# EAGLE design js220_evk1 (EAGLE 9.6.2)
REVISION: B
Assembly variants: Standard

## Sheet 1 of 2
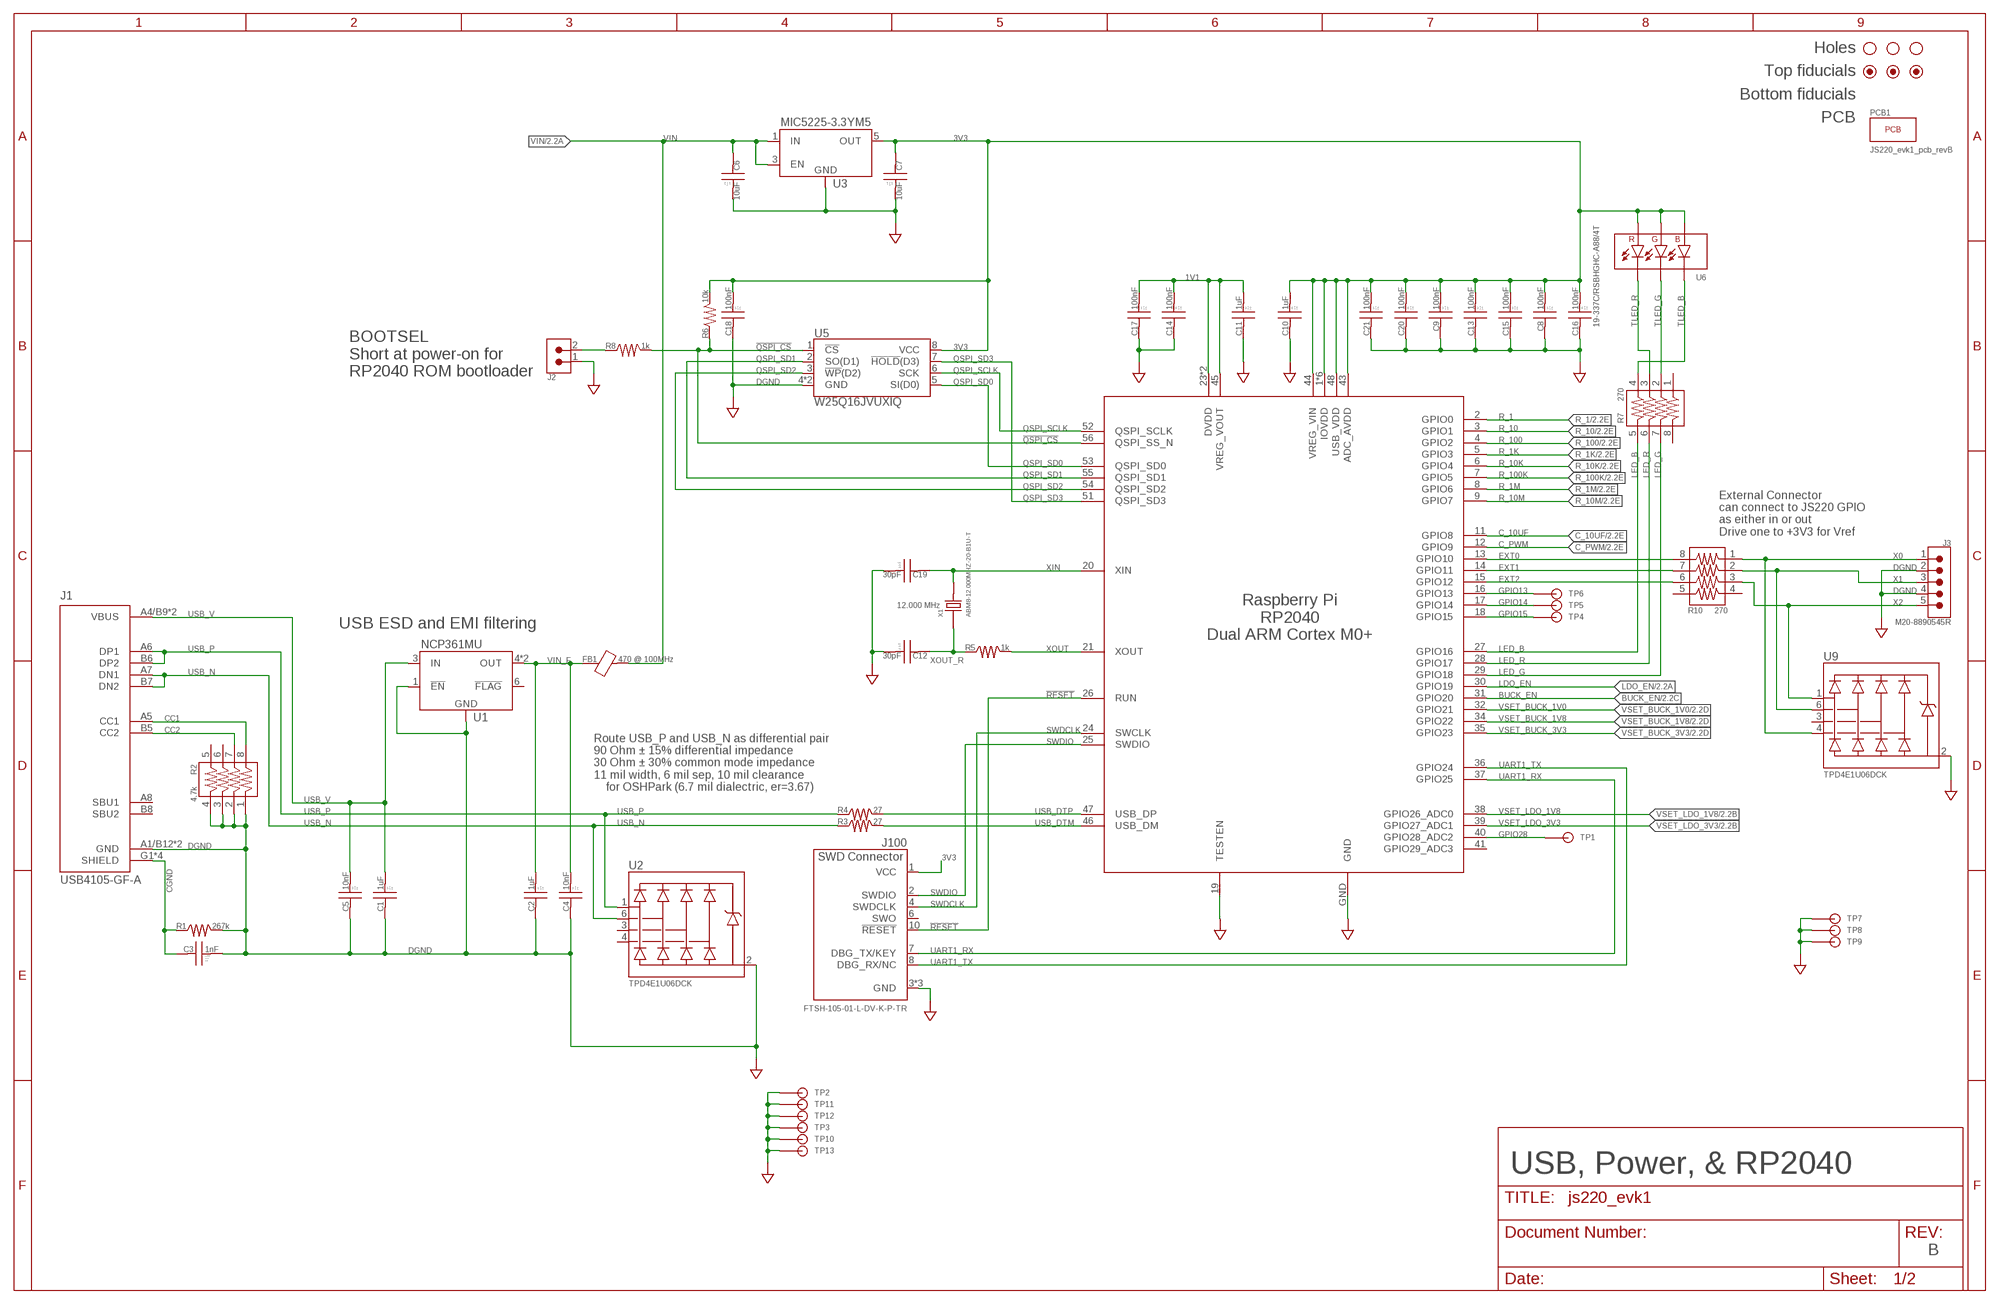
[diagram p0: schematic, sheet 1]
PCB1 (PCB): POPULATE: 1

### Parts
C1  1uF  CAP_0603  [0603]
C2  1uF  CAP_0603  [0603]
C3  1nF  CAP_0805  [0805]
C4  10nF  CAP_0402  [0402]
C5  10nF  CAP_0402  [0402]
C6  10uF  CAP_1206  [1206]
C7  10uF  CAP_0805  [0805]
C8  100nF  CAP_0402  [0402]
C9  100nF  CAP_0402  [0402]
C10  1uF  CAP_0603  [0603]
C11  1uF  CAP_0603  [0603]
C12  30pF  CAP_0402  [0402]
C13  100nF  CAP_0402  [0402]
C14  100nF  CAP_0402  [0402]
C15  100nF  CAP_0402  [0402]
C16  100nF  CAP_0402  [0402]
C17  100nF  CAP_0402  [0402]
C18  100nF  CAP_0402  [0402]
C19  30pF  CAP_0402  [0402]
C20  100nF  CAP_0402  [0402]
C21  100nF  CAP_0402  [0402]
FB1  470 @ 100MHz  FERRITE_BEAD_0603  [0603]
FD1  DNI  FIDUCIAL_1MM  [FIDUCIAL_1MM_2MM]  (not fitted in variant Standard)
FD2  DNI  FIDUCIAL_1MM  [FIDUCIAL_1MM_2MM]  (not fitted in variant Standard)
FD3  DNI  FIDUCIAL_1MM  [FIDUCIAL_1MM_2MM]  (not fitted in variant Standard)
H1  STAND-OFFTIGHT  [STAND-OFF-TIGHT]
H2  STAND-OFFTIGHT  [STAND-OFF-TIGHT]
H3  STAND-OFFTIGHT  [STAND-OFF-TIGHT]
J1  USB4105-GF-A  USB4105_REVA  [GCT_USB4105_REVA]
J2  CONN_0.1_2X1  [CONN_0.1_2X1_M]
J3  M20-8890545R  CONN_0.1_5X1_MSR  [CONN_0.1_5X1_MSR]
J100  FTSH-105-01-L-DV-K-P-TR  ARM_SWD_10_0.05_2X10_S  [CONN_0.050_5X2_M_SM]
R1  267k  RESISTOR_0402  [0402]
R2  4.7k  RESISTOR_4_0804  [0402X4]
R3  27  RESISTOR_0402  [0402]
R4  27  RESISTOR_0402  [0402]
R5  1k  RESISTOR_0402  [0402]
R6  10k  RESISTOR_0402  [0402]
R7  270  RESISTOR_4_0804  [0402X4]
R8  1k  RESISTOR_0402  [0402]
R10  270  RESISTOR_4_0804  [0402X4]
TP1  TPTP-PTH0.02  [TP-PTH0.02]
TP2  TPTP-PTH0.02  [TP-PTH0.02]
TP3  TPTP-PTH0.02  [TP-PTH0.02]
TP4  TPTP-PTH0.02  [TP-PTH0.02]
TP5  TPTP-PTH0.02  [TP-PTH0.02]
TP6  TPTP-PTH0.02  [TP-PTH0.02]
TP7  TPTP-PTH0.02  [TP-PTH0.02]
TP8  TPTP-PTH0.02  [TP-PTH0.02]
TP9  TPTP-PTH0.02  [TP-PTH0.02]
TP10  TPTP-PTH0.02  [TP-PTH0.02]
TP11  TPTP-PTH0.02  [TP-PTH0.02]
TP12  TPTP-PTH0.02  [TP-PTH0.02]
TP13  TPTP-PTH0.02  [TP-PTH0.02]
U1  NCP361MU  [UDFN-6]
U2  TPD4E1U06DCK  TVS_4UNI_DCK  [SC-70-6]
U3  MIC5225-3.3YM5  VREG_FIXED+_ENTPS70960DBV  [SOT23-5]
U4  RP2040  [QFN-56G]
U5  W25Q16JVUXIQ  FLASH_SERIAL8_USON8_2X3  [USON-8_2X3]
U6  19-337C/RSBHGHC-A88/4T  LED_RGB6_1.6X1.6  [LED_RGB6_1.6X1.6]
U9  TPD4E1U06DCK  TVS_4UNI_DCK  [SC-70-6]
X1  ABM8-12.000MHZ-20-B1U-T  XTAL-2_XTAL4_3.2X2.5  [XTAL4_3.2X2.5]

### Nets
1V1: C11.2 C14.2 C17.2 U4.23(DVDD) U4.45(VREG_VOUT) U4.50(DVDD)
3V3: C7.1 C8.2 C9.2 C10.2 C13.2 C15.2 C16.2 C18.2 C20.2 C21.2 J100.1(VCC) R6.2 U3.5(OUT) U4.1(IOVDD) U4.10(IOVDD) U4.22(IOVDD) U4.33(IOVDD) U4.42(IOVDD) U4.43(ADC_AVDD) U4.44(VREG_VIN) U4.48(USB_VDD) U4.49(IOVDD) U5.8(VCC) U6.2(GREEN_ANODE+) U6.4(RED_ANODE+) U6.6(BLUE_ANODE+)
!QSPI_CS: R6.1 R8.2 U4.56(QSPI_SS_N) U5.1(!CS!)
!RESET: J100.10(!RESET) U4.26(RUN)
BUCK_EN: U4.31(GPIO20) ; also sheet 2
C_10UF: U4.11(GPIO8) ; also sheet 2
C_PWM: U4.12(GPIO9) ; also sheet 2
CC1: J1.A5(CC1) R2.8(1B)
CC2: J1.B5(CC2) R2.7(2B)
CGND: C3.1 J1.G1(SHIELD) J1.G2(SHIELD) J1.G3(SHIELD) J1.G4(SHIELD) R1.1
DGND: C1.1 C2.1 C3.2 C4.1 C5.1 C6.2 C7.2 C8.1 C9.1 C10.1 C11.1 C12.2 C13.1 C14.1 C15.1 C16.1 C17.1 C18.1 C19.2 C20.1 C21.1 J1.A1/B12(GND) J1.B1/A12(GND) J2.1 J3.2 J3.4 J100.3(GND) J100.5(GND) J100.9(GND) R1.2 R2.1(1A) R2.2(2A) R2.3(3A) R2.4(4A) TP2.1(TP) TP3.1(TP) TP7.1(TP) TP8.1(TP) TP9.1(TP) TP10.1(TP) TP11.1(TP) TP12.1(TP) TP13.1(TP) U1.1(!EN) U1.2(GND) U1.GND@PAD(GND) U2.2(GND) U3.2(GND) U4.19(TESTEN) U4.GND U5.4(GND) U5.9(GND) U9.2(GND) ; supply symbol labelled GND_SIGNAL ; also sheet 2
EXT0: R10.8(1B) U4.13(GPIO10)
EXT1: R10.7(2B) U4.14(GPIO11)
EXT2: R10.6(3B) U4.15(GPIO12)
GPIO13: TP6.1(TP) U4.16(GPIO13)
GPIO14: TP5.1(TP) U4.17(GPIO14)
GPIO15: TP4.1(TP) U4.18(GPIO15)
GPIO28: TP1.1(TP) U4.40(GPIO28_ADC2)
LDO_EN: U4.30(GPIO19) ; also sheet 2
LED_B: R7.5(4B) U4.27(GPIO16)
LED_G: R7.7(2B) U4.29(GPIO18)
LED_R: R7.6(3B) U4.28(GPIO17)
N$1: J2.2 R8.1
QSPI_SCLK: U4.52(QSPI_SCLK) U5.6(SCK)
QSPI_SD0: U4.53(QSPI_SD0) U5.5(SI(D0))
QSPI_SD1: U4.55(QSPI_SD1) U5.2(SO(D1))
QSPI_SD2: U4.54(QSPI_SD2) U5.3(!WP!(D2))
QSPI_SD3: U4.51(QSPI_SD3) U5.7(!HOLD!(D3))
R_1: U4.2(GPIO0) ; also sheet 2
R_1K: U4.5(GPIO3) ; also sheet 2
R_1M: U4.8(GPIO6) ; also sheet 2
R_10: U4.3(GPIO1) ; also sheet 2
R_10K: U4.6(GPIO4) ; also sheet 2
R_10M: U4.9(GPIO7) ; also sheet 2
R_100: U4.4(GPIO2) ; also sheet 2
R_100K: U4.7(GPIO5) ; also sheet 2
SWDCLK: J100.4(SWDCLK) U4.24(SWCLK)
SWDIO: J100.2(SWDIO) U4.25(SWDIO)
TLED_B: R7.4(4A) U6.5(BLUE_CATHODE-)
TLED_G: R7.2(2A) U6.1(GREEN_CATHODE-)
TLED_R: R7.3(3A) U6.3(RED_CATHODE-)
UART1_RX: J100.7(DBG_TX/KEY) U4.37(GPIO25)
UART1_TX: J100.8(DBG_RX/NC) U4.36(GPIO24)
USB_DTM: R3.2 U4.46(USB_DM)
USB_DTP: R4.2 U4.47(USB_DP)
USB_N [USB]: J1.A7(DN1) J1.B7(DN2) R3.1 U2.6(D1-)
USB_P [USB]: J1.A6(DP1) J1.B6(DP2) R4.1 U2.1(D1+)
USB_V: C1.2 C5.2 J1.A4/B9(VBUS) J1.B4/A9(VBUS) U1.3(IN)
VIN: C6.1 FB1.2 U3.1(IN) U3.3(EN) ; also sheet 2
VIN_F: C2.2 C4.2 FB1.1 U1.4(OUT) U1.5(OUT)
VSET_BUCK_1V0: U4.32(GPIO21) ; also sheet 2
VSET_BUCK_1V8: U4.34(GPIO22) ; also sheet 2
VSET_BUCK_3V3: U4.35(GPIO23) ; also sheet 2
VSET_LDO_1V8: U4.38(GPIO26_ADC0) ; also sheet 2
VSET_LDO_3V3: U4.39(GPIO27_ADC1) ; also sheet 2
X0: J3.1 R10.1(1A) U9.4(D2-)
X1: J3.3 R10.2(2A) U9.6(D1-)
X2: J3.5 R10.3(3A) U9.1(D1+)
XIN: C19.1 U4.20(XIN) X1.3
XOUT: R5.2 U4.21(XOUT)
XOUT_R: C12.1 R5.1 X1.1
Unconnected: J1.A8(SBU1) J1.B8(SBU2) J100.6(SWO) R2.5(4B) R2.6(3B) R7.1(1A) R7.8(1B) R10.4(4A) R10.5(4B) U1.6(!FLAG) U2.3(D2+) U2.4(D2-) U4.41(GPIO29_ADC3) U9.3(D2+)

### Notes on the sheet
- Holes
  Top fiducials
  Bottom fiducials
  PCB
- BOOTSEL
  Short at power-on for
  RP2040 ROM bootloader
- External Connector
  can connect to JS220 GPIO
  as either in or out
  Drive one to +3V3 for Vref
- 12.000 MHz
- USB ESD and EMI filtering
- Route USB_P and USB_N as differential pair
  90 Ohm ± 15% differential impedance
  30 Ohm ± 30% common mode impedance
  11 mil width, 6 mil sep, 10 mil clearance
      for OSHPark (6.7 mil dialectric, er=3.67)
- USB, Power, & RP2040

## Sheet 2 of 2
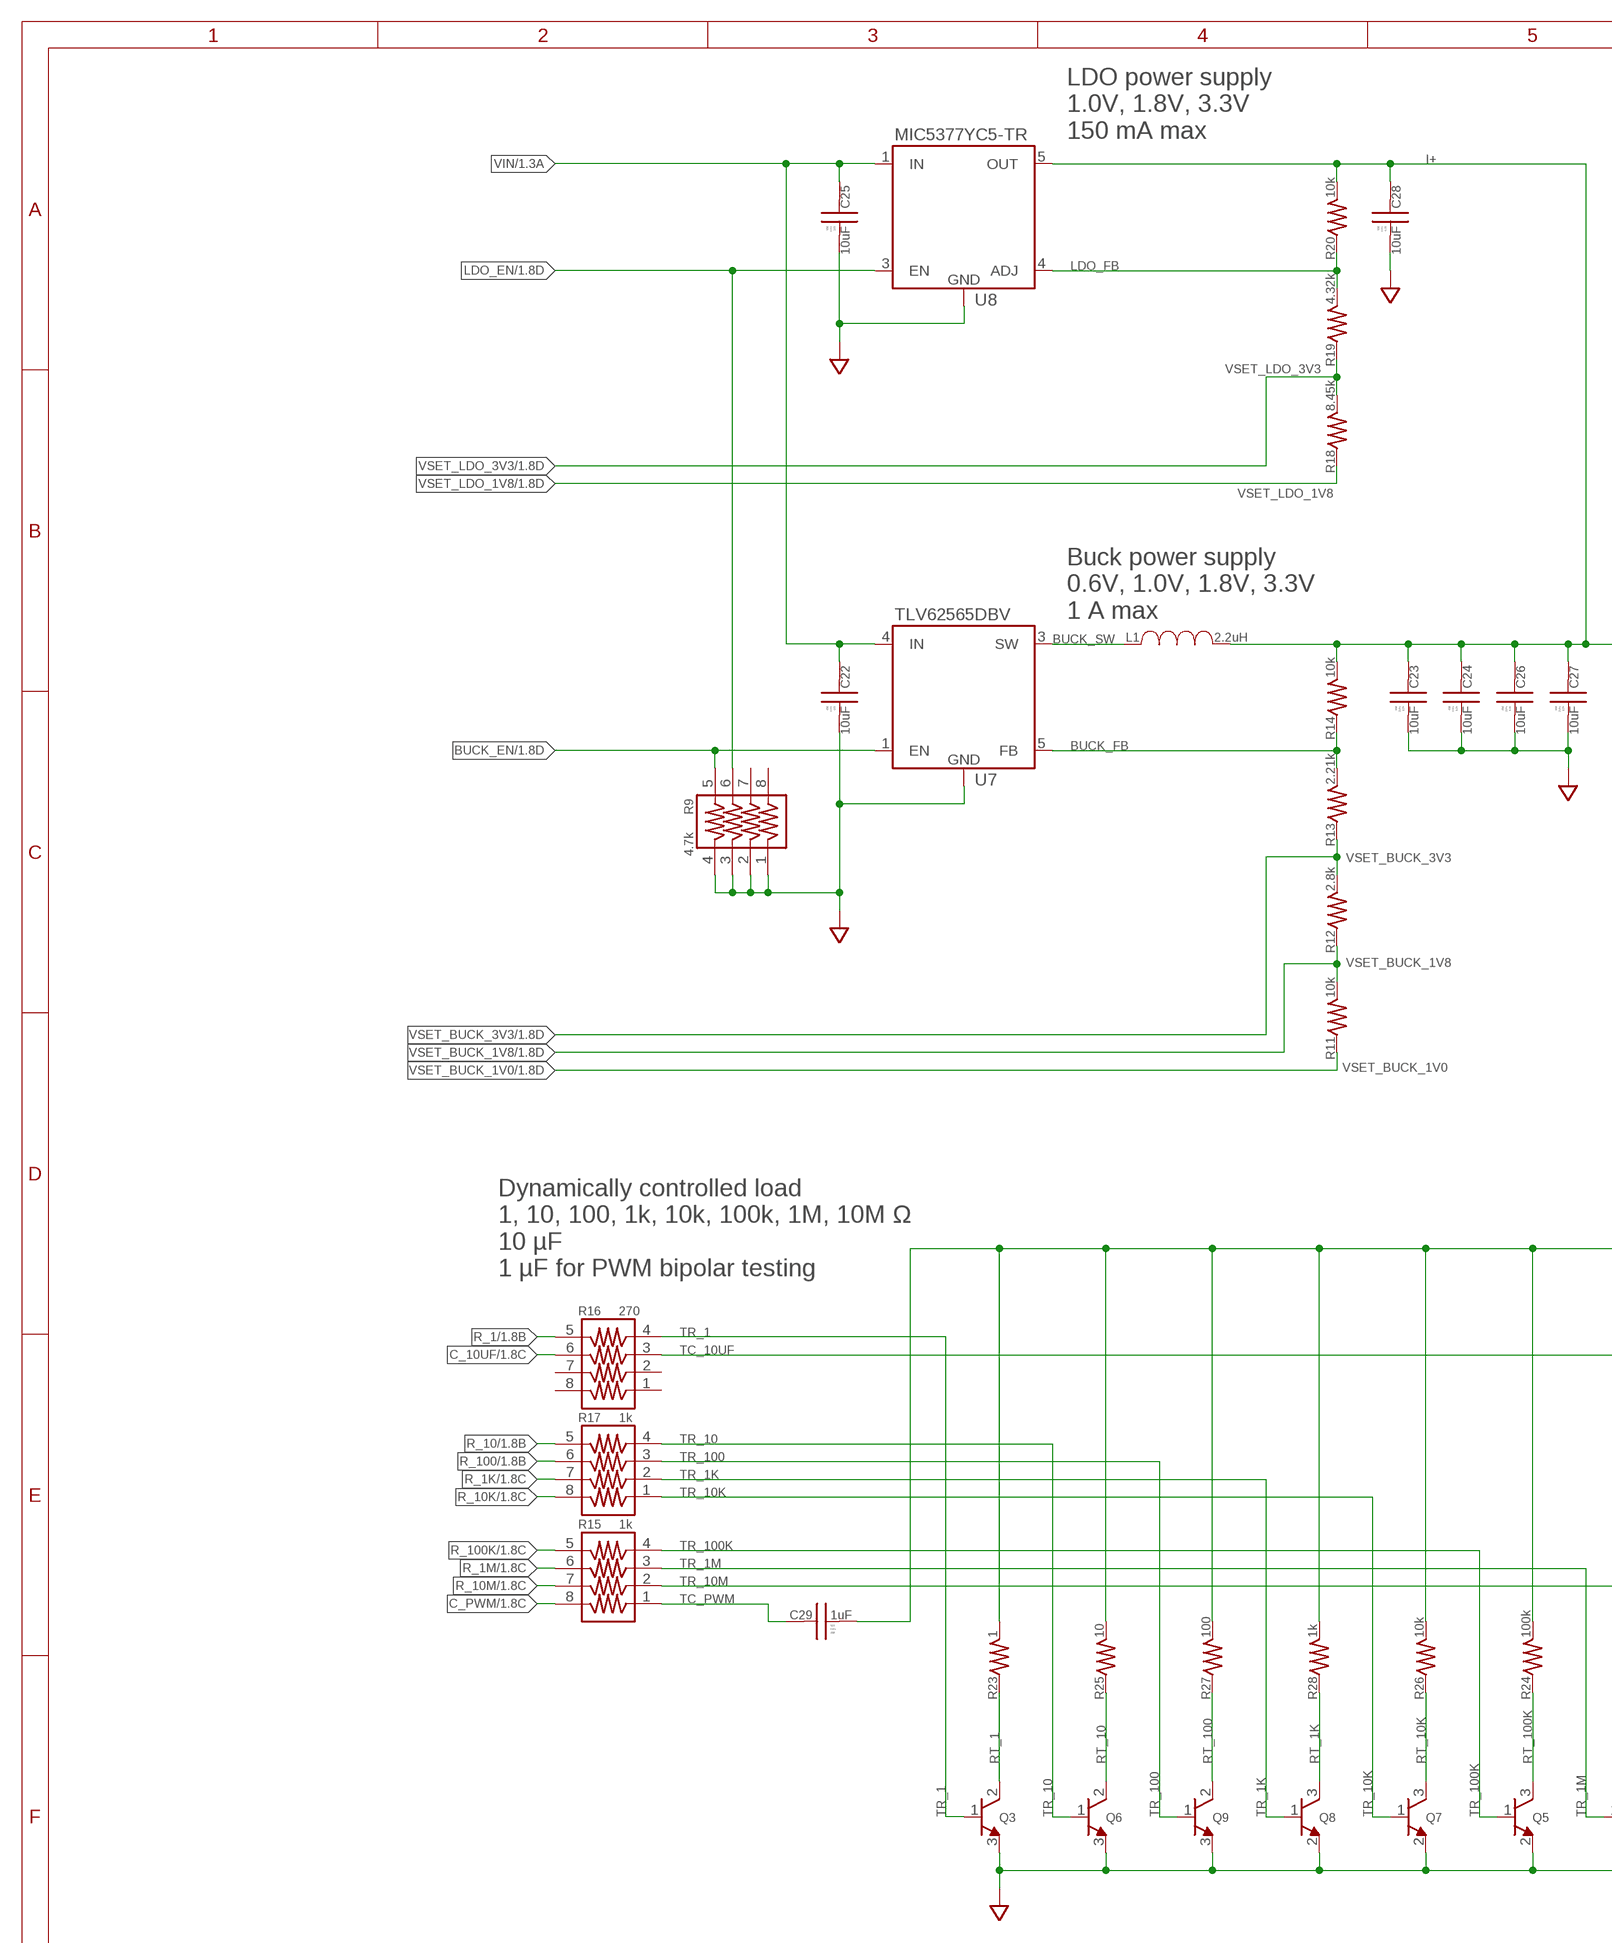
[diagram p1: schematic, sheet 2, part 1 of 2]
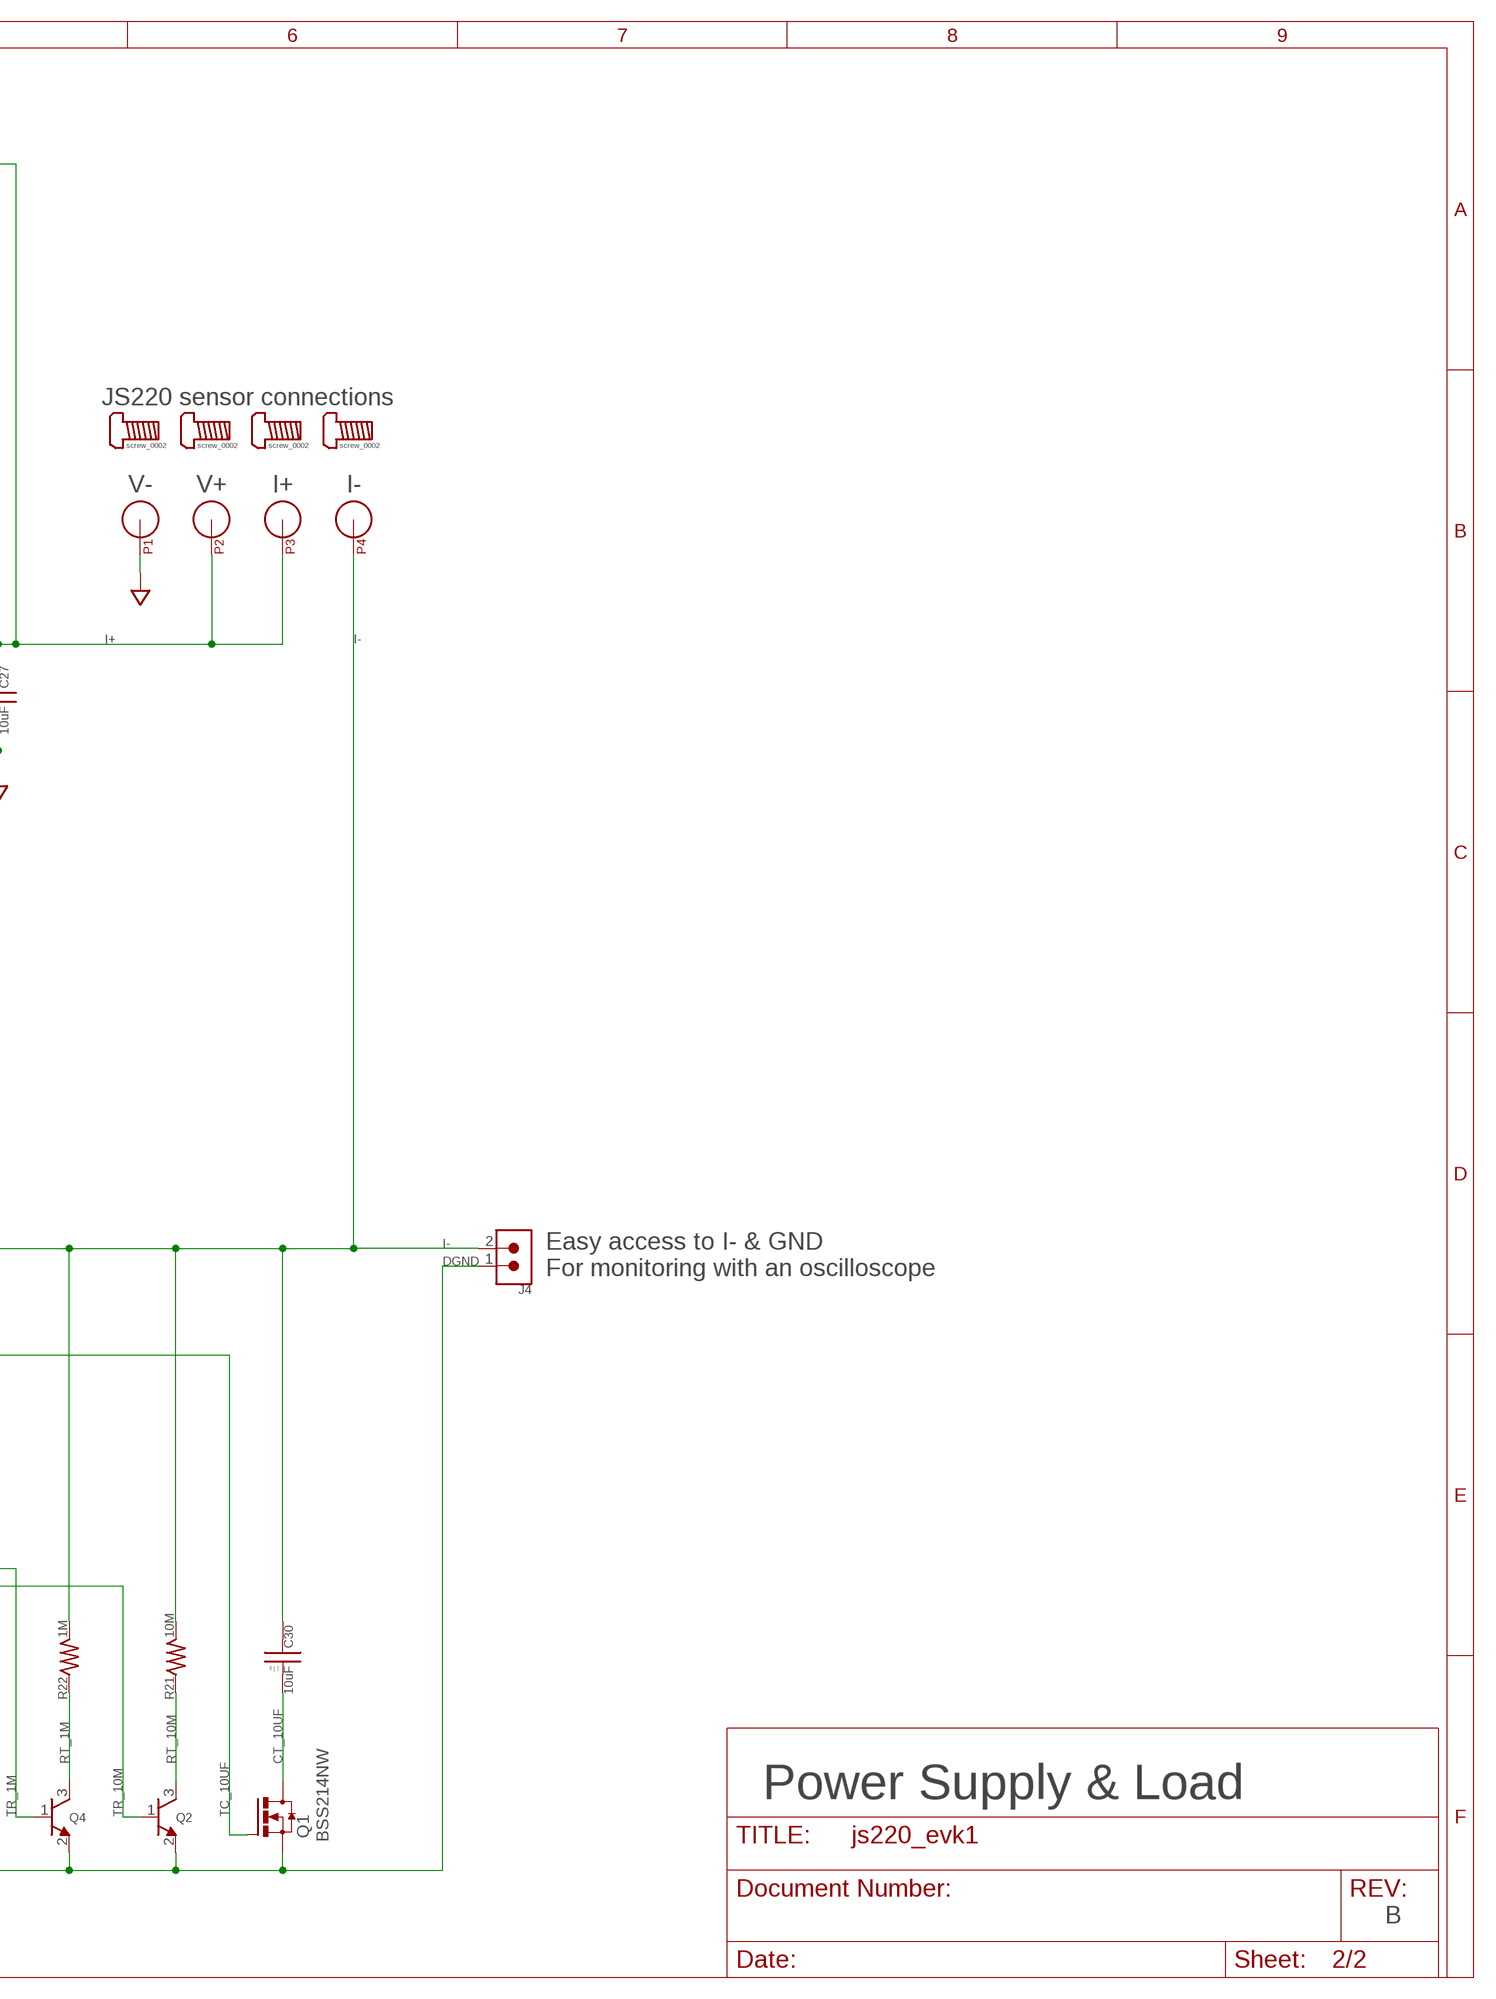
[diagram p2: schematic, sheet 2, part 2 of 2]
U$1 (SCREW): POPULATE: 1
U$2 (SCREW): POPULATE: 1
U$3 (SCREW): POPULATE: 1
U$4 (SCREW): POPULATE: 1

### Parts
C22  10uF  CAP_1206  [1206]
C23  10uF  CAP_0805  [0805]
C24  10uF  CAP_0805  [0805]
C25  10uF  CAP_1206  [1206]
C26  10uF  CAP_0805  [0805]
C27  10uF  CAP_0805  [0805]
C28  10uF  CAP_0805  [0805]
C29  1uF  CAP_0603  [0603]
C30  10uF  CAP_0805  [0805]
J4  CONN_0.1_2X1  [CONN_0.1_2X1_M]
L1  2.2uH  INDUCTOR_LPS4018  [LPS4018]
P1  P55-271F40N  BANANA-PLUG72918  [72918]
P2  P55-271F40N  BANANA-PLUG72918  [72918]
P3  P55-271F40N  BANANA-PLUG72918  [72918]
P4  P55-271F40N  BANANA-PLUG72918  [72918]
Q1  BSS214NW  MOSFET_N_SOT323_GSD  [SOT323-3]
Q2  BC848W  BJT_NPN_SOT323  [SOT323-3]
Q3  PBSS4240X  BJT_NPN_SOT89  [SOT-89]
Q4  BC848W  BJT_NPN_SOT323  [SOT323-3]
Q5  BC848W  BJT_NPN_SOT323  [SOT323-3]
Q6  PBSS4240X  BJT_NPN_SOT89  [SOT-89]
Q7  BC848W  BJT_NPN_SOT323  [SOT323-3]
Q8  BC848W  BJT_NPN_SOT323  [SOT323-3]
Q9  PBSS4240X  BJT_NPN_SOT89  [SOT-89]
R9  4.7k  RESISTOR_4_0804  [0402X4]
R11  10k  RESISTOR_0402  [0402]
R12  2.8k  RESISTOR_0402  [0402]
R13  2.21k  RESISTOR_0402  [0402]
R14  10k  RESISTOR_0402  [0402]
R15  1k  RESISTOR_4_0804  [0402X4]
R16  270  RESISTOR_4_0804  [0402X4]
R17  1k  RESISTOR_4_0804  [0402X4]
R18  8.45k  RESISTOR_0402  [0402]
R19  4.32k  RESISTOR_0402  [0402]
R20  10k  RESISTOR_0402  [0402]
R21  10M  RESISTOR_0402  [0402]
R22  1M  RESISTOR_0402  [0402]
R23  1  RESISTOR_2512  [2512]
R24  100k  RESISTOR_0402  [0402]
R25  10  RESISTOR_2512  [2512]
R26  10k  RESISTOR_0402  [0402]
R27  100  RESISTOR_1206  [1206]
R28  1k  RESISTOR_0402  [0402]
U7  TLV62565DBV  [SOT23-5]
U8  MIC5377YC5-TR  VREG+_FB_EN_MIC5376-YC5  [SC-70-5]

### Nets
BUCK_EN: R9.5(4B) U7.1(EN) ; also sheet 1
BUCK_FB: R13.2 R14.1 U7.5(FB)
BUCK_SW: L1.1 U7.3(SW)
C_10UF: R16.6(3B) ; also sheet 1
C_PWM: R15.8(1B) ; also sheet 1
CT_10UF: C30.2 Q1.3(D)
DGND: C22.2 C23.2 C24.2 C25.2 C26.2 C27.2 C28.2 J4.1 P1.1 Q1.2(S) Q2.2(EMITTER) Q3.3(EMITTER) Q4.2(EMITTER) Q5.2(EMITTER) Q6.3(EMITTER) Q7.2(EMITTER) Q8.2(EMITTER) Q9.3(EMITTER) R9.1(1A) R9.2(2A) R9.3(3A) R9.4(4A) U7.2(GND) U8.2(GND) ; supply symbol labelled GND_SIGNAL ; also sheet 1
I+: C23.1 C24.1 C26.1 C27.1 C28.1 L1.2 P2.1 P3.1 R14.2 R20.2 U8.5(OUT)
I-: C29.2 C30.1 J4.2 P4.1 R21.2 R22.2 R23.2 R24.2 R25.2 R26.2 R27.2 R28.2
LDO_EN: R9.6(3B) U8.3(EN) ; also sheet 1
LDO_FB: R19.2 R20.1 U8.4(ADJ)
R_1: R16.5(4B) ; also sheet 1
R_1K: R17.7(2B) ; also sheet 1
R_1M: R15.6(3B) ; also sheet 1
R_10: R17.5(4B) ; also sheet 1
R_10K: R17.8(1B) ; also sheet 1
R_10M: R15.7(2B) ; also sheet 1
R_100: R17.6(3B) ; also sheet 1
R_100K: R15.5(4B) ; also sheet 1
RT_1: Q3.2(COLLECTOR) R23.1
RT_1K: Q8.3(COLLECTOR) R28.1
RT_1M: Q4.3(COLLECTOR) R22.1
RT_10: Q6.2(COLLECTOR) R25.1
RT_10K: Q7.3(COLLECTOR) R26.1
RT_10M: Q2.3(COLLECTOR) R21.1
RT_100: Q9.2(COLLECTOR) R27.1
RT_100K: Q5.3(COLLECTOR) R24.1
TC_10UF: Q1.1(G) R16.3(3A)
TC_PWM: C29.1 R15.1(1A)
TR_1: Q3.1(BASE) R16.4(4A)
TR_1K: Q8.1(BASE) R17.2(2A)
TR_1M: Q4.1(BASE) R15.3(3A)
TR_10: Q6.1(BASE) R17.4(4A)
TR_10K: Q7.1(BASE) R17.1(1A)
TR_10M: Q2.1(BASE) R15.2(2A)
TR_100: Q9.1(BASE) R17.3(3A)
TR_100K: Q5.1(BASE) R15.4(4A)
VIN: C22.1 C25.1 U7.4(IN) U8.1(IN) ; also sheet 1
VSET_BUCK_1V0: R11.1 ; also sheet 1
VSET_BUCK_1V8: R11.2 R12.1 ; also sheet 1
VSET_BUCK_3V3: R12.2 R13.1 ; also sheet 1
VSET_LDO_1V8: R18.1 ; also sheet 1
VSET_LDO_3V3: R18.2 R19.1 ; also sheet 1
Unconnected: R9.7(2B) R9.8(1B) R16.1(1A) R16.2(2A) R16.7(2B) R16.8(1B)

### Notes on the sheet
- LDO power supply
  1.0V, 1.8V, 3.3V
  150 mA max
- JS220 sensor connections
- V- | V+ | I+ | I-
- Buck power supply
  0.6V, 1.0V, 1.8V, 3.3V
  1 A max
- Dynamically controlled load
  1, 10, 100, 1k, 10k, 100k, 1M, 10M Ω
  10 µF
  1 µF for PWM bipolar testing
- Easy access to I- & GND
  For monitoring with an oscilloscope
- Power Supply & Load

## Library data of the parts
C1 C2 C10 C11 C29 = jetperch:CAP; DIELECTRIC: X5R; POPULATE: 1; TOLERANCE: 20%; VOLTAGE: 50V
C3 = jetperch:CAP; DIELECTRIC: X5R; POPULATE: 1; TOLERANCE: 20%; VOLTAGE: 1000V
C4 C5 C8 C9 C13-C18 C20 C21 = jetperch:CAP; DIELECTRIC: X7R; POPULATE: 1; TOLERANCE: 10%; VOLTAGE: 50V
C6 C22 C25 = jetperch:CAP; DIELECTRIC: X5R; POPULATE: 1; TOLERANCE: 20%; VOLTAGE: 10V
C7 C23 C24 C26-C28 C30 = jetperch:CAP; DIELECTRIC: X5R; POPULATE: 1; TOLERANCE: 20%; VOLTAGE: 6.3V
C12 C19 = jetperch:CAP; DIELECTRIC: C0G; POPULATE: 1; TOLERANCE: 5%; VOLTAGE: 50V
FB1 = jetperch:FERRITE_BEAD; PN: FB0603_470; POPULATE: 1
FD1-FD3 = jetperch:FIDUCIAL; POPULATE: 0
H1-H3 = jetperch:STAND-OFF: #4 Stand Off This is the mechanical footprint for a #4 phillips button head screw. Use the keepout ring to avoid running the screw head into surrounding components. SKU : PRT-00447; POPULATE: 0
J1 = jetperch:USB4105_REVA: USB Type C Receptacle for USB 2.0 SMT Type, PCB Top Mount USB4105-GF-A; DESCRIPTION: USB-C (USB TYPE-C) USB 2.0 Receptacle Connector 24 (16+8 Dummy) Position Surface Mount, Right Angle; Through Hole; DIGI-KEY_PART_NUMBER: 2073-USB4105-GF-ACT-ND; MF: Global Connector Technology; MP: USB4105; MPN: USB4105-GF-A; PACKAGE: Package; POPULATE: 1
J2 J4 = jetperch:CONN_0.1_2X1: 2x1 0.1" header; POPULATE: 0
J3 = jetperch:CONN_0.1_5X1; MPN: M20-8890545R; POPULATE: 1
J100 = jetperch:ARM_SWD_10; MPN: FTSH-105-01-L-DV-K-P-TR; POPULATE: 0
L1 = jetperch:INDUCTOR; MPN: NRS4018T2R2MDGJ; POPULATE: 1
P1-P4 = jetperch:BANANA-PLUG; POPULATE: 1
Q1 = jetperch:MOSFET_N; MPN: BSS214NWH6327XTSA1; POPULATE: 1
Q2 Q4 Q5 Q7 Q8 = jetperch:BJT_NPN; POPULATE: 1
Q3 Q6 Q9 = jetperch:BJT_NPN; MPN: PBSS4240X; POPULATE: 1
R1 R3 R4 R21 R22 = jetperch:RESISTOR; POPULATE: 1; TEMP_CO: 100 ppm/°C; TOLERANCE: 1%; WATTAGE: 0.062W
R2 R7 R9 R10 R15-R17 = jetperch:RESISTOR_4: Matching footprints: 1206x4 For panasonic EXB-V8V series resistors 0402x4 for panasonc ECB28V series resistors; POPULATE: 1; TEMP_CO: 200 ppm/°C; TOLERANCE: 5%; WATTAGE: 0.062W
R5 R8 R11-R14 R20 R24 R26 R28 = jetperch:RESISTOR; POPULATE: 1; TEMP_CO: 25 ppm/°C; TOLERANCE: 0.1%; WATTAGE: 0.062W
R6 = jetperch:RESISTOR; POPULATE: 0; TEMP_CO: 25 ppm/°C; TOLERANCE: 0.1%; WATTAGE: 0.062W
R18 R19 = jetperch:RESISTOR; POPULATE: 1; TEMP_CO: 25 ppm/°C; TOLERANCE: 1%; WATTAGE: 0.062W
R23 R25 = jetperch:RESISTOR; POPULATE: 1; TEMP_CO: 100 ppm/°C; TOLERANCE: 1%; WATTAGE: 2W
R27 = jetperch:RESISTOR; POPULATE: 1; TEMP_CO: 100 ppm/°C; TOLERANCE: 1%; WATTAGE: 0.5W
TP1-TP13 = jetperch:TP: https://www.smithsinterconnect.com/ for S-075, S-100, S4; POPULATE: 0
U1 = jetperch:NCP361; MPN: NCP361MUTBG; POPULATE: 1
U2 U9 = jetperch:TVS_4UNI: For TI TPD4E1U06; PN: TPD4E1U06DCK; POPULATE: 1
U3 = jetperch:VREG_FIXED+_EN: Positive fixed voltage regulators with enable.; MPN: MIC5225-3.3YM5-TR; POPULATE: 1
U4 = jetperch:RP2040; MPN: RP2040; POPULATE: 1
U5 = jetperch:FLASH_SERIAL8: Winbond W25Q32FV 32Mbit (4MB) Flash The W25Q32FV support the standard Serial Peripheral Interface (SPI), Dual/Quad I/O SPI as well as 2-clocks instruction cycle Quad Peripheral Interface (QPI). Datasheet <http://www.winbond.com/resource-files/w25q32fv%20revh%20091613.pdf>; MPN: W25Q16JVUXIQ TR; POPULATE: 1
U6 = jetperch:LED_RGB6: Options include: 6PLCC compatible with Lite-On LTST-G683GEBW 1.6x1.6 compatible with Everlight 19-337C/RSBHGHC-A88/4T; MPN: 19-337C/RSBHGHC-A88/4T; POPULATE: 1
U7 = jetperch:TLV62565: TI TLV62565 in SOT23-5; MPN: TLV62565DBV; POPULATE: 1
U8 = jetperch:VREG+_FB_EN; MPN: MIC5377YC5-TR; POPULATE: 1
X1 = jetperch:XTAL-2; MPN: ABM8-12.000MHZ-20-B1U-T; POPULATE: 1

## Net classes
0 default: width 0.127 mm, drill 0.254 mm, clearance 0.127 mm
1 USB: clearance 0.508 mm to class 0, clearance 0.254 mm
2 EXT_NEG: drill 0.254 mm, clearance 0.635 mm to class 0, clearance 0.635 mm to class 1, clearance 0.152 mm
3 CGND: clearance 0.254 mm to class 0, clearance 1.016 mm to class 1, clearance 1.016 mm to class 2, clearance 0.254 mm

## Board
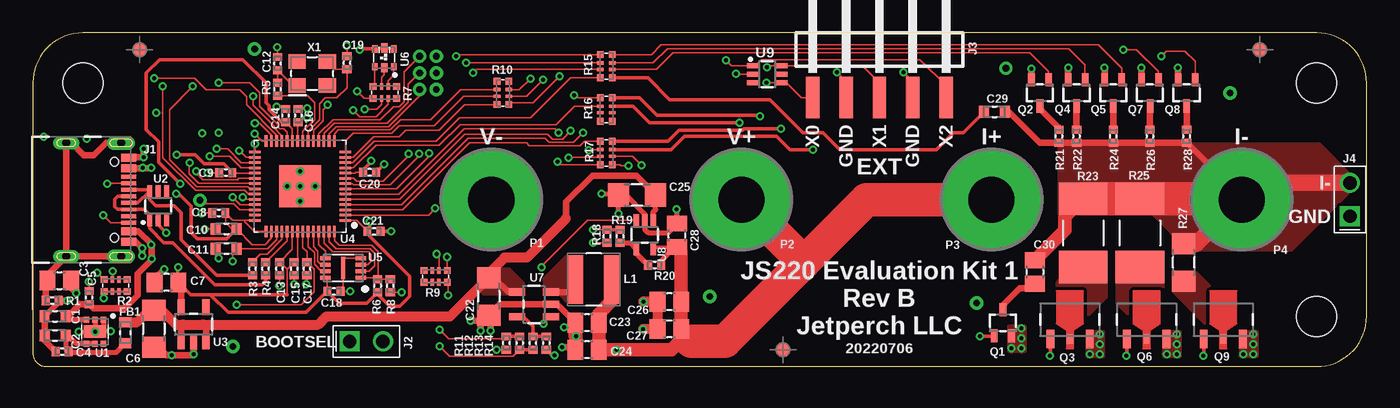
[diagram p3: board, top side]
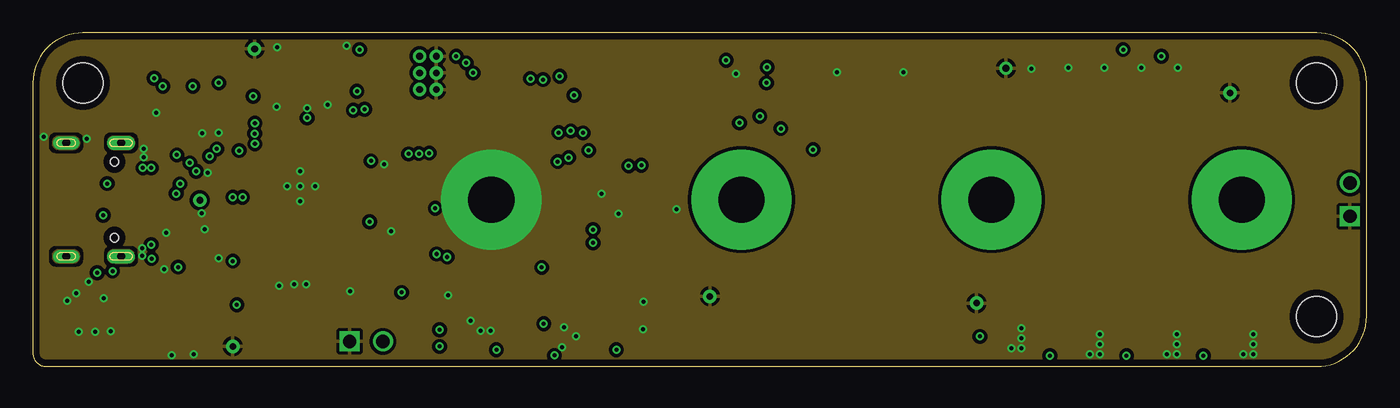
[diagram p4: board, inner layer Route2]
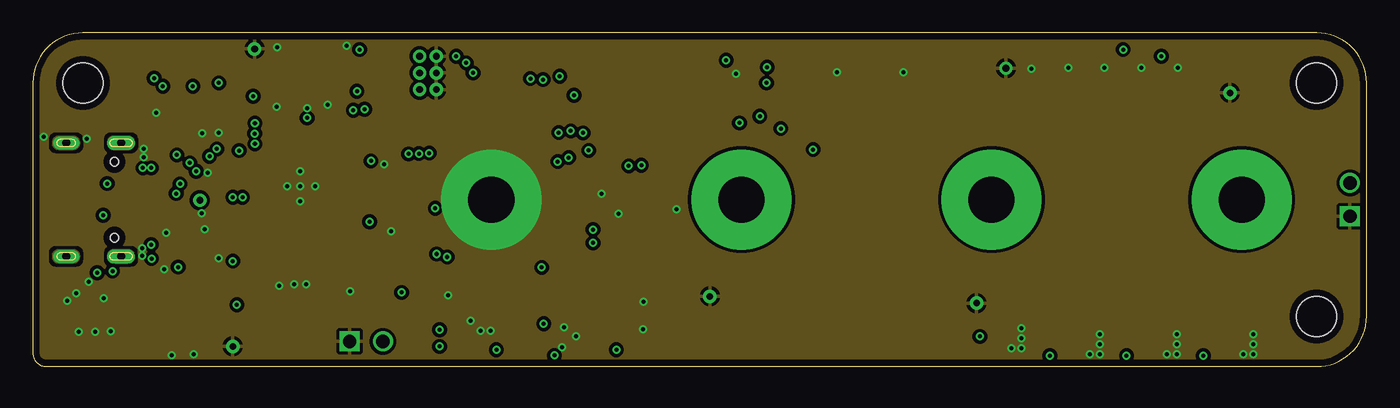
[diagram p5: board, inner layer Route15]
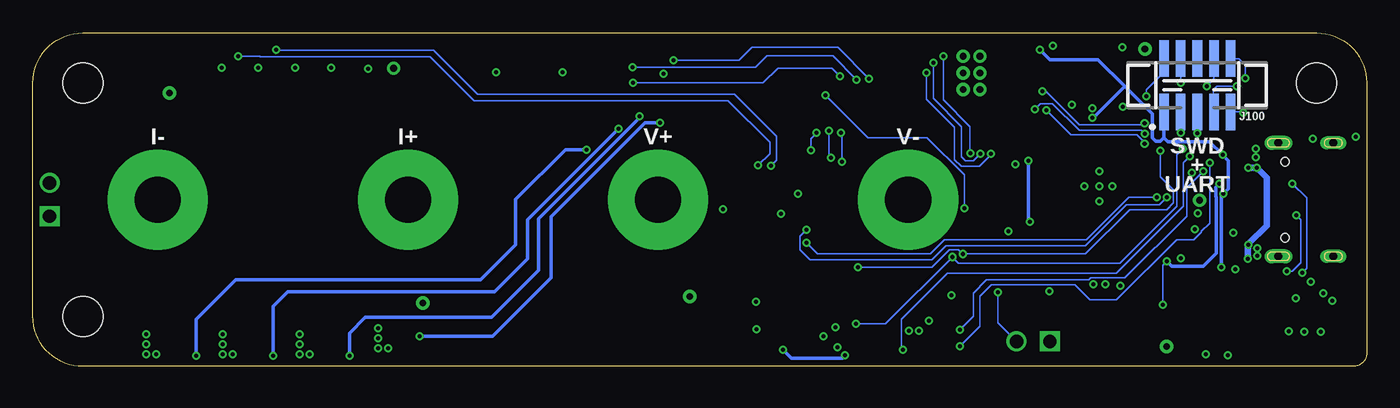
[diagram p6: board, bottom side, seen from below]

Size 101.6 x 25.4 mm. Coordinates in mm from the lower left corner, seen from the top.
Outline: 101.6,3.81 101.6,21.59 arc90 97.79,25.4 3.81,25.4 arc90 0,21.59 0,1.02 arc90 1.02,0 97.79,0 arc90 101.6,3.81
Copper layers (1+2*15+16): Top 0.035559375mm / dielectric 0.17018125mm / Route2 0.01778125mm / dielectric 47mil / Route15 0.01778125mm / dielectric 0.17018125mm / Bottom 0.035559375mm
Design rules "jetperch_4layer_5mil *": minimum track width 5mil, minimum drill 12mil, track to track 5mil, track to pad 5mil, pad to pad 5mil, via to via 5mil, smd to smd 0mil, copper to edge 20mil, drill to drill 8mil, minimum pad ring 6mil, minimum via ring 6mil, stop-mask expansion 0mil, vias tented up to drill 14mil, thermal gap 10mil

### Footprints (pad centres in the part's own frame; a part is rotated, then mirrored left to right if it is on the bottom)
0603 = smd 0.75 x 0.9: 1 -0.8,0; 2 0.8,0
0805 = smd 1.198 x 1.5: 1 -0.899,0; 2 0.899,0
0402 = smd 0.6 x 0.7: 1 -0.5,0; 2 0.5,0
1206 = smd 1.6 x 1.803: 1 -1.422,0; 2 1.422,0
FIDUCIAL_1MM_2MM = smd 1.016 x 1.016: P1 0,0
STAND-OFF-TIGHT = hole 3.048: 0,0
GCT_USB4105_REVA = smd 0.6 x 1.15: A1/B12 -3.2,4.755; A4/B9 -2.4,4.755; B1/A12 3.2,4.755; B4/A9 2.4,4.755 | smd 0.3 x 1.15: A5 -1.25,4.755; A6 -0.25,4.755; A7 0.25,4.755; A8 1.25,4.755; B5 1.75,4.755; B6 0.75,4.755; B7 -0.75,4.755; B8 -1.75,4.755 | drill 0.6 pad 1 long: G1 -4.32,0; G2 4.32,0 | drill 0.6 pad 1.05 long: G3 -4.32,4.18; G4 4.32,4.18 | hole 0.65: 2.89,3.68; -2.89,3.68
CONN_0.1_2X1_M = drill 1.016 square: 1 -1.27,0 | drill 1.016: 2 1.27,0
CONN_0.1_5X1_MSR = smd 1.02 x 3.17: 1 -5.08,-3.665; 2 -2.54,-3.665; 3 0,-3.665; 4 2.54,-3.665; 5 5.08,-3.665
CONN_0.050_5X2_M_SM = smd 0.737 x 2.794: 1 -2.54,-2.032; 2 -2.54,2.032; 3 -1.27,-2.032; 4 -1.27,2.032; 5 0,-2.032; 6 0,2.032; 7 1.27,-2.032; 8 1.27,2.032; 9 2.54,-2.032; 10 2.54,2.032
LPS4018 = smd 1.2 x 3.7: 1 -1.4,0; 2 1.4,0
72918 = drill 3.505 pad 7.62: 1 0,0
SOT323-3 = smd 0.5 x 1: 1 -0.65,-1; 2 0.65,-1; 3 0,1
SOT-89 = smd 0.6 x 1.4: 1 -1.5,-1.475; 3 1.5,-1.475 | smd 0.45 x 0.7: 2 0,-1.475
0402X4 = smd 0.525 x 0.5: 1 -0.887,-0.45; 4 0.887,-0.45; 5 0.887,0.45; 8 -0.887,0.45 | smd 0.25 x 0.5: 2 -0.25,-0.45; 3 0.25,-0.45; 6 0.25,0.45; 7 -0.25,0.45
2512 = smd 2.438 x 3.708: 1 -2.591,0; 2 2.591,0
TP-PTH0.02 = drill 0.508 pad 1.016: 1 0,0
UDFN-6 = smd 0.4 x 0.47: 1 -0.65,-0.915; 2 0,-0.915; 3 0.65,-0.915; 4 0.65,0.915; 5 0,0.915; 6 -0.65,0.915 | smd 1.7 x 0.95: GND@PAD 0,0
SC-70-6 = smd 0.4 x 0.9: 1 -0.65,-1.1; 2 0,-1.1; 3 0.65,-1.1; 4 0.65,1.1; 5 0,1.1; 6 -0.65,1.1
SOT23-5 = smd 0.55 x 1.2: 1 -0.95,-1.3; 2 0,-1.3; 3 0.95,-1.3; 4 0.95,1.3; 5 -0.95,1.3
QFN-56G = smd 0.875 x 0.2: 1 -3.438,2.6; 2 -3.438,2.2; 3 -3.438,1.8; 4 -3.438,1.4; 5 -3.438,1; 6 -3.438,0.6; 7 -3.438,0.2; 8 -3.438,-0.2; 9 -3.438,-0.6; 10 -3.438,-1; 11 -3.438,-1.4; 12 -3.438,-1.8; 13 -3.438,-2.2; 14 -3.438,-2.6; 29 3.438,-2.6; 30 3.438,-2.2; 31 3.438,-1.8; 32 3.438,-1.4; 33 3.438,-1; 34 3.438,-0.6; 35 3.438,-0.2; 36 3.438,0.2; 37 3.438,0.6; 38 3.438,1; 39 3.438,1.4; 40 3.438,1.8; 41 3.438,2.2; 42 3.438,2.6 | smd 0.2 x 0.875: 15 -2.6,-3.438; 16 -2.2,-3.438; 17 -1.8,-3.438; 18 -1.4,-3.438; 19 -1,-3.438; 20 -0.6,-3.438; 21 -0.2,-3.438; 22 0.2,-3.438; 23 0.6,-3.438; 24 1,-3.438; 25 1.4,-3.438; 26 1.8,-3.438; 27 2.2,-3.438; 28 2.6,-3.438; 43 2.6,3.438; 44 2.2,3.438; 45 1.8,3.438; 46 1.4,3.438; 47 1,3.438; 48 0.6,3.438; 49 0.2,3.438; 50 -0.2,3.438; 51 -0.6,3.438; 52 -1,3.438; 53 -1.4,3.438; 54 -1.8,3.438; 55 -2.2,3.438; 56 -2.6,3.438 | smd 3.2 x 3.2: GND 0,0
USON-8_2X3 = smd 0.3 x 0.8: 1 -0.75,-1.35; 2 -0.25,-1.35; 3 0.25,-1.35; 4 0.75,-1.35; 5 0.75,1.35; 6 0.25,1.35; 7 -0.25,1.35; 8 -0.75,1.35 | smd 1.7 x 0.3: 9 0,0
LED_RGB6_1.6X1.6 = smd 0.4 x 0.55: 1 -0.725,0.675; 2 -0.725,-0.675; 5 0.725,0.675; 6 0.725,-0.675 | smd 0.5 x 0.7: 3 0,0.75; 4 0,-0.75
SC-70-5 = smd 0.4 x 0.9: 1 -0.65,-1.1; 2 0,-1.1; 3 0.65,-1.1; 4 0.65,1.1; 5 -0.65,1.1
XTAL4_3.2X2.5 = smd 1.3 x 1.1: 1 -1.15,-0.9; 2 1.15,-0.9; 3 1.15,0.9; 4 -1.15,0.9

### Placement (x,y rotation side)
C1  1.69,3.81 0 top
C2  1.7,2.35 0 top
C3  2.03,6.53 0 top
C4  2.24,1.13 0 top
C5  4.29,5.25 270 top
C6  9.22,2.87 270 top
C7  10.19,6.4 180 top
C8  14.17,11.68 0 top
C9  14.71,14.76 0 top
C10  14.73,10.46 0 top
C11  14.73,8.97 0 top
C12  18.64,23.06 90 top
C13  18.8,7.44 90 top
C14  19.25,19.1 270 top
C15  19.91,7.44 90 top
C16  20.22,19.1 270 top
C17  20.88,7.44 90 top
C18  22.94,5.71 180 top
C19  23.93,23.11 90 top
C20  25.65,14.78 180 top
C21  25.98,10.29 180 top
C22  34.72,5.33 270 top
C23  42.21,3.33 180 top
C24  42.21,1.27 180 top
C25  46.02,13.06 180 top
C26  48.49,4.93 180 top
C27  48.49,2.84 180 top
C28  49.07,9.98 90 top
C29  73.25,19.38 0 top
C30  76.33,7.19 270 top
DOCFIELD_PCB  [DOCFIELD]  131.57,-104.9 0 top  (outside the outline)
FB1  7.05,2.57 90 top
FD1  8.13,24.13 0 top
FD2  57.15,1.27 0 top
FD3  93.47,24.13 0 top
FRAME_PCB  [FRAME_A_L]  -42.42,-105.54 0 top  (outside the outline)
H1  3.81,21.59 0 top
H2  97.79,21.59 0 top
H3  97.79,3.81 0 top
J1  2.54,12.7 270 top
J2  25.4,1.91 0 top
J3  64.49,24.13 0 top
J4  100.33,12.7 90 top
J100  12.9,21.41 0 bottom
L1  42.72,6.63 0 top
P1  34.92,12.7 0 top
P2  53.98,12.7 0 top
P3  73.03,12.7 0 top
P4  92.08,12.7 0 top
Q1  73.89,3.33 0 top
Q2  76.71,20.83 180 top
Q3  78.99,3.56 0 top
Q4  79.5,20.83 180 top
Q5  82.3,20.83 180 top
Q6  84.84,3.56 0 top
Q7  85.09,20.83 180 top
Q8  87.88,20.83 180 top
Q9  90.68,3.56 0 top
R1  1.48,5.02 0 top
R2  6.32,6.16 0 top
R3  16.74,7.44 90 top
R4  17.73,7.44 90 top
R5  18.64,21.11 270 top
R6  26.26,6.15 270 top
R7  26.82,20.85 180 top
R8  27.23,6.15 90 top
R9  30.68,6.86 0 top
R10  35.81,20.83 90 top
R11  36.07,1.78 90 top
R12  37.08,1.78 270 top
R13  38.1,1.78 90 top
R14  39.12,1.78 270 top
R15  43.69,22.86 90 top
R16  43.69,19.56 90 top
R17  43.69,16.26 90 top
R18  43.74,9.91 90 top
R19  44.73,9.91 270 top
R20  47.37,7.72 0 top
R21  78.16,17.53 270 top
R22  79.5,17.53 270 top
R23  80.01,10.16 90 top
R24  82.3,17.53 270 top
R25  84.33,10.16 90 top
R26  85.09,17.53 270 top
R27  87.66,7.92 90 top
R28  87.88,17.53 270 top
TP1  12.73,12.65 0 top
TP2  15.24,1.52 0 top
TP3  16.89,24.18 0 top
TP4  29.46,23.62 0 top
TP5  29.46,22.35 0 top
TP6  29.46,21.08 0 top
TP7  30.73,23.62 0 top
TP8  30.73,22.35 0 top
TP9  30.73,21.08 0 top
TP10  51.56,5.33 0 top
TP11  71.88,4.83 90 top
TP12  74.12,22.71 0 top
TP13  91.19,20.83 0 top
U1  4.74,2.64 180 top
U2  9.55,12.23 0 top
U3  12.24,3.2 0 top
U4  20.37,13.72 180 top
U5  23.65,7.49 90 top
U6  26.77,23.5 180 top
U7  38.18,4.72 90 top
U8  46.61,10.03 180 top
U9  55.93,22.25 270 top
X1  21.29,22.3 0 top

### Tracks (layer width: path | path; a pad name or v marks a point on that pad's centre or on a via)
1V1  (via drill 0.3)
  Top 0.127: U4.23 19.77,18.08 C14.2 | U4.50 20.57,9.02 20.88,8.71 C17.2 21.42,7.4 21.42,5.67 20.45,4.7 v15.54,4.7 | U4.45 18.57,9.63 17.9,8.97 C11.2 15.24,8.67 v15.24,8.03
  Top 0.254: C14.2 18.94,18.6 18.01,19.53 18.01,19.84 17.78,20.07 17.78,21.59 16,23.37 9.65,23.37 8.64,22.35 8.64,18.03 9.58,17.09 9.58,15.53 v11.21,13.89
  Bottom 0.127: v15.54,4.7 15.54,7.72 v15.24,8.03
  Bottom 0.254: v15.24,8.03 14.83,7.62 12.45,7.62 11.45,8.62 11.45,12.89 11.48,12.93 11.48,13.62 v11.21,13.89
3V3  (via drill 0.3)
  Top 0.127: U4.22 20.17,18.55 C16.2 | U4.10 24.52,14.72 24.57,14.77 25.14,14.77 C20.2 | U4.1 24.66,11.12 C21.2 | C18.2 22.44,6.6 U5.8 | U4.49 20.17,8.2 C15.2 19.36,7.38 | U4.48 19.77,8.92 C13.2 19.36,7.38 | U4.44 18.17,9.76 17.68,9.27 16.73,9.27 C10.2 15.14,10.46 14.67,10.93 C8.2 15.24,11.12 16.13,11.12 | U4.43 16.85,10.28 16.13,11 16.13,11.12 | U4.33 15.25,14.72 C9.2 | U4.42 16.13,11.12 | 19.36,7.38 19.36,5.46
  Top 0.254: C10.2 14.77,9.7 12.52,9.7 12.06,10.16 12.06,12.19 11.09,13.16 v10.92,13.16 | C7.1 12.03,5.46 13.53,5.46 | 13.53,5.46 14.87,4.12 20.84,4.12 C18.2 22.88,5.27 22.88,5.26 23.32,4.83 25.44,4.83 R6.2 26.26,5.49 27.18,4.57 27.94,4.57 28.7,5.33 28.7,6.86 25.65,9.91 v25.65,11.02 25.65,10.46 C21.2 | v11.07,7.56 11.04,7.56 11.04,6.36 | C20.2 25.15,14.97 25.76,15.57 v25.76,15.65 | C16.2 20.54,18.92 v20.89,18.92 | U6.2 27.42,24.25 U6.4 26.12,24.25 U6.6 24.93,24.17 v24.89,24.13 | C9.2 14.76,15.2 14.76,15.21 14.55,15.42 13.06,15.42 12.37,16.1 v10.97,16.1 | 13.53,5.46 19.36,5.46
  Top 0.508: U3.5 11.29,6.19 C7.1 11.04,6.36
  Bottom 0.254: v25.76,15.65 25.76,11.12 v25.65,11.02 | v11.07,7.56 11.07,13.01 v10.92,13.16 10.54,13.54 10.54,15.67 v10.97,16.1 11.99,17.12 15.14,17.12 15.44,17.42 | v20.89,18.92 20.71,19.1 20.67,19.1 18.44,21.34 | v24.89,24.13 24.13,23.37 20.47,23.37 18.44,21.34 | J100.1 15.44,17.42 | 18.44,21.34 16.33,19.23 16.33,17.42 16.05,17.14 15.72,17.14 15.44,17.42
!QSPI_CS
  Top 0.127: U4.56 22.97,9.57 23.32,9.22 25.79,9.22 26.29,8.72 26.29,6.73 | 26.29,6.73 26.29,6.67 R6.1 R8.2 | U5.1 26.28,6.74 26.29,6.73
!RESET  (via drill 0.3)
  Top 0.127: U4.26 18.57,17.62 16.28,19.91 16.28,20.55 15.75,21.08 13.21,21.08 12.34,21.95 v9.25,21.95
  Bottom 0.127: v9.25,21.95 9.25,22.94 9.75,23.44 J100.10
BUCK_EN  (via drill 0.3)
  Top 0.127: v31.57,8.33 R9.5 | U7.1 39.26,3.77 38.91,3.43 v38.91,3.25 | U4.31 15.88,15.52 14.83,16.56 v14.02,16.56
  Bottom 0.127: v38.91,3.25 36.65,3.25 v31.57,8.33 31.11,7.87 18.8,7.87 14.48,12.19 14.48,16.1 v14.02,16.56
BUCK_FB
  Top 0.254: R14.1 R13.2 38.1,3.05 37.37,3.77 U7.5
BUCK_SW
  Top 0.508: U7.3 40.84,5.66 41.32,6.14 L1.1
  pour Top (isolate 0.254, no thermals): 38.99,5.71 38.99,6.73 40.61,8.36 41.66,8.36 41.66,4.9 40.74,4.9 40.16,5.49 39.22,5.49
C_10UF
  Top 0.127: U4.11 24.41,15.12 26.14,16.84 30.96,16.84 32.53,18.41 39.86,18.41 41.26,19.81 R16.6
C_PWM
  Top 0.127: R15.8 40.95,21.97 37.9,18.92 32.51,18.92 30.73,17.14 25.99,17.14 24.37,15.52 U4.12
CC1  (via drill 0.3)
  Top 0.127: R2.8 v4.9,7.14 | J1.A5 5.7,13.95 v5.66,13.92
  Bottom 0.127: v5.66,13.92 4.57,12.83 4.57,7.47 v4.9,7.14
CC2  (via drill 0.3)
  Top 0.127: v6.07,7.26 R2.7 | J1.B5 5.92,10.95 v5.36,11.51
  Bottom 0.127: v5.36,11.51 5.02,11.16 5.02,7.91 5.66,7.26 v6.07,7.26
CGND
  Top 0.508: J1.G2 1.13,6.97 C3.1 0.98,6.39 R1.1 | J1.G3 5.59,17.02 4.65,16.08 3.89,16.08 2.95,17.02 J1.G1 J1.G2 | J1.G4 J1.G2
  pour Route2 (isolate 0.254, no thermals): 6.2,7.87 7.24,7.87 arc90 7.75,8.38 arc90 7.24,8.89 6.2,8.89 arc90 5.69,8.38 arc90
  pour Route15 (isolate 0.254, no thermals): 6.2,7.87 7.24,7.87 arc90 7.75,8.38 arc90 7.24,8.89 6.2,8.89 arc90 5.69,8.38 arc90
  pour Route15 (isolate 0.254, no thermals): 2.01,7.87 3.05,7.87 arc90 3.56,8.38 arc90 3.05,8.89 2.01,8.89 arc90 1.5,8.38 arc90
  pour Route2 (isolate 0.254, no thermals): 2.01,7.87 3.05,7.87 arc90 3.56,8.38 arc90 3.05,8.89 2.01,8.89 arc90 1.5,8.38 arc90
  pour Route2 (isolate 0.254, no thermals): 2.01,16.51 3.05,16.51 arc90 3.56,17.02 arc90 3.05,17.53 2.01,17.53 arc90 1.5,17.02 arc90
  pour Route2 (isolate 0.254, no thermals): 6.2,16.51 7.24,16.51 arc90 7.75,17.02 arc90 7.24,17.53 6.2,17.53 arc90 5.69,17.02 arc90
  pour Route15 (isolate 0.254, no thermals): 2.01,16.51 3.05,16.51 arc90 3.56,17.02 arc90 3.05,17.53 2.01,17.53 arc90 1.5,17.02 arc90
  pour Route15 (isolate 0.254, no thermals): 6.2,16.51 7.24,16.51 arc90 7.75,17.02 arc90 7.24,17.53 6.2,17.53 arc90 5.69,17.02 arc90
CT_10UF
  Top 0.508: Q1.3 73.89,4.66 75.18,5.96 76,5.96 C30.2
DGND  (via drill 0.3)
  Top 0.127: v5.41,5.18 5.43,5.2 R2.1 R2.2 R2.3 R2.4 | C5.1 4.29,6.43 v4.27,6.45 | C14.1 19.13,19.73 18.88,19.73 18.85,19.76 v18.57,19.76 | v20.9,19.66 20.84,19.6 C16.1 | C12.2 18.64,24.26 v18.59,24.31 | C19.2 23.93,24.38 v23.9,24.41 | U5.4 23.74,8.24 23.62,8.13 23.62,7.52 | 23.62,7.52 U5.9 | 23.62,7.52 23.62,5.9 C18.1 v24.18,5.71 | C9.1 13.34,14.76 v13.31,14.73 | C8.1 12.9,11.68 v12.88,11.66 | C10.1 13.11,10.46 v13.08,10.44 | C13.1 18.8,6.2 v18.75,6.15 | C15.1 v19.91,6.25 | C17.1 20.88,6.33 v20.8,6.25 | v14.17,8.25 13.93,8.48 C11.1 | U4.19 21.37,17.96 22.1,18.69 22.1,19.55 v22.47,19.91 | R9.1 R9.2 R9.3 R9.4 31.65,6.33 31.65,5.44 v31.62,5.41 | J3.2 61.95,21.69 v61.24,22.4 | J3.4 67.03,21.69 v66.32,22.4 | U9.2 53.57,22.25 v53.54,22.28
  Top 0.254: U2.2 9.55,10.77 v10.16,10.16 | C21.1 v27.3,10.29 | C20.1 26.16,14.78 v26.77,15.39
  Top 0.381: C1.1 1.98,4.9 R1.2 | U1.2 U1.GND@PAD | U1.1 5.39,2.86 5.19,2.67 | U1.GND@PAD 5.17,2.64 5.19,2.67 | v3.48,2.64 U1.GND@PAD | v5.94,2.67 5.19,2.67 | v49.05,11.96 49.07,11.94 C28.2 48.38,10.19 46.86,10.19 46.61,10.44 U8.2 46.63,11.15 46.63,11.56 45.13,13.06 C25.2 | v44.63,11.63 44.6,11.66 C25.2 | v43.31,13.13 44.53,13.13 C25.2
  Top 0.508: R1.2 2.6,5.02 v2.62,5 | C3.2 2.92,5.94 v3.3,5.56 | C1.1 0.89,2.36 C2.1 0.9,1.96 C4.1 | J1.B1/A12 7.82,9.5 v8.33,8.99 v8.33,8.43 | J1.A1/B12 7.32,15.93 v8.46,15.93 v8.46,16.56 | C7.2 9.29,6.7 v10.01,7.42 | U3.2 v12.24,0.91 12.17,0.84 v10.57,0.84 10.54,0.86 10.19,0.86 9.6,1.45 C6.2 | C24.2 41.14,1.45 v40.31,1.45 | C22.2 35.53,4.72 U7.2 39.94,4.72 41.32,3.35 C23.2 41.17,3.33 40.82,2.97 v40.46,2.97 | Q7.2 84.44,22.75 v84.43,22.76 | Q8.2 87.23,22.75 v87.22,22.76 | Q5.2 v81.65,22.72 v81.64,22.73 | Q4.2 78.85,22.74 v78.87,22.76 | Q2.2 v76.06,22.67 v76.05,22.68 | v33.35,3.48 34.04,3.48 | 34.04,3.48 34.29,3.48 C22.2 | v34.11,2.72 34.11,3.4 34.04,3.48 | v34.87,2.72 34.87,3.76 C22.2
  Top 0.762: v46.51,4.93 C26.2 C27.2 v46.48,2.85
  Top 1.016: C23.2 41.32,2.37 v41.38,2.31 41.38,1.33 C24.2
  Bottom 0.127: J100.3 v14.17,17.8 | J100.5 v12.9,17.75 | J100.9 9.46,19.38 v9.41,19.33
  other vias: 4.75,2.64 4.11,17.35 20.37,13.72 19.35,13.72 20.37,12.57 21.51,13.72 20.37,14.86 0.81,17.5 80.52,0.94 86.36,0.94 87.12,1.7 87.12,0.94 87.12,2.46 92.2,0.94 92.96,0.94 92.96,1.7 92.96,2.46 81.28,0.94 81.28,1.7 81.28,2.46 75.31,1.37 74.55,1.37 75.31,2.13 75.31,2.9
  pour Route2 (isolate 0.254, rank 6): 0,0 0,25.4 101.6,25.4 101.6,0
  pour Route15 (isolate 0.254, rank 6): 0,0 0,25.4 101.6,25.4 101.6,0
  pour Top (isolate 0.254, no thermals): 80.31,2.64 80.31,0.76 81.53,0.76 81.53,2.64
  pour Top (isolate 0.254, no thermals): 86.16,2.64 86.16,0.76 87.38,0.76 87.38,2.64
  pour Top (isolate 0.254, no thermals): 92,2.64 92,0.76 93.22,0.76 93.22,2.64
  pour Top (isolate 0.254, no thermals): 74.35,3.05 74.35,1.17 75.56,1.17 75.56,3.05
  cutout Route2: 53.98,8.89 arc-90 50.16,12.7 arc-90 53.98,16.51 arc-90 57.78,12.7 arc-90
  cutout Route2: 73.03,8.89 arc-90 69.22,12.7 arc-90 73.03,16.51 arc-90 76.83,12.7 arc-90
  cutout Route2: 92.08,8.89 arc-90 88.27,12.7 arc-90 92.08,16.51 arc-90 95.89,12.7 arc-90
  cutout Route15: 92.08,8.89 arc-90 88.27,12.7 arc-90 92.08,16.51 arc-90 95.89,12.7 arc-90
DGND1
  cutout Route15: 53.98,8.89 arc-90 50.16,12.7 arc-90 53.98,16.51 arc-90 57.78,12.7 arc-90
  cutout Route15: 73.03,8.89 arc-90 69.22,12.7 arc-90 73.03,16.51 arc-90 76.83,12.7 arc-90
EXT0
  Top 0.127: U4.13 24.41,15.92 25.96,17.47 27.89,17.47 28.4,17.98 30.94,17.98 32.9,19.94 R10.8
EXT1
  Top 0.127: U4.14 23.81,17.18 24.38,17.75 27.32,17.75 27.9,18.34 30.56,18.34 32.8,20.58 R10.7
EXT2
  Top 0.127: U4.15 22.97,17.71 23.27,18.01 27.21,18.01 28,18.8 30.3,18.8 32.58,21.08 R10.6
GPIO13
  Top 0.127: U4.16 22.57,17.72 23.11,18.26 27.11,18.26 29.46,20.62 TP6.1
GPIO14
  Top 0.127: U4.17 22.17,17.75 22.94,18.52 27,18.52 28.6,20.11 28.6,21.49 TP5.1
GPIO15
  Top 0.127: U4.18 21.77,17.71 22.86,18.8 24.76,18.8 24.79,18.77 26.47,18.77 27.49,19.79 27.91,19.79 28.3,20.17 28.3,22.45 TP4.1
GPIO28
  Top 0.127: U4.40 15.77,11.92 15.31,12.38 12.99,12.38 TP1.1
I+  (via drill 0.3)
  Top 0.254: v39.73,0.84 39.56,0.84 R14.2 | U8.5 47.41,9.08 48.9,9.08 C28.1
  Top 0.381: R20.2 47.87,8.06 48.9,9.08
  Top 1.016: C27.1 C26.1 49.39,8.77 C28.1 | C27.1 49.39,2.02 48.64,1.27 v44.45,1.27 C24.1 C23.1 43.11,4.01 44.12,5.02 L1.2 | 50.16,1.91 49.39,2.68 C27.1
  Top 2.54: P3.1 63.5,12.7 58.74,7.94 | 58.74,7.94 52.7,1.91 50.16,1.91 | P2.1 58.74,7.94
  Bottom 0.254: v39.73,0.84 39.93,0.64 43.81,0.64 v44.45,1.27
I-
  Top 0.254: 78.15,17.02 R21.2
  Top 0.508: R21.2 R22.2 R24.2 R26.2 R28.2 92.02,12.89 92.02,12.75 | C29.2 74.35,19.38 76.71,17.02 78.15,17.02
  Top 1.016: C30.1 78.61,10.37 78.61,11.4 79.96,12.75 R23.2
  Top 1.27: J4.2 93.24,13.97 92.02,12.75 88.62,9.35 R27.2
  Top 2.54: R23.2 R25.2 92.02,12.75 P4.1
  pour Top (isolate 0.254, no thermals): 98.02,16.92 78.21,16.92 78.21,11.61 85.29,11.61 88.01,8.89 95.89,8.89 100.33,13.34 100.33,14.61
LDO_EN  (via drill 0.3)
  Top 0.127: v30.76,8.56 30.94,8.38 R9.6 | U8.3 42.25,11.13 38.76,7.64 v38.76,7.54 | U4.30 16.27,15.92 15.75,16.43 v15.72,16.43
  Bottom 0.127: v38.76,7.54 33.12,7.54 31.77,8.89 31.09,8.89 v30.76,8.56 21.41,8.56 18.03,11.94 15.24,11.94 14.73,12.45 14.73,13.46 15.72,14.45 v15.72,16.43
LDO_FB
  Top 0.381: R19.2 45.49,9.41 U8.4 45.96,8.63 R20.1
LED_B  (via drill 0.3)
  Top 0.127: R7.5 25.24,20.4 v24.69,20.95 | U4.27 18.17,17.64 17.32,18.49 16.94,18.49 v16.92,18.52
  Bottom 0.127: v24.69,20.95 24.43,20.95 21.87,18.39 17.04,18.39 v16.92,18.52
LED_G  (via drill 0.3)
  Top 0.127: R7.7 27.07,19.96 26.14,19.02 24.89,19.02 v24.41,19.51 | v16.92,16.94 16.93,16.93 U4.29
  Bottom 0.127: v16.92,16.94 16.92,17.04 17.5,17.63 22.53,17.63 v24.41,19.51
LED_R  (via drill 0.3)
  Top 0.127: R7.6 26.57,19.97 26.19,19.58 v25.27,19.58 | U4.28 17.47,17.15 v16.89,17.73
  Bottom 0.127: v16.89,17.73 17.14,17.98 21.89,17.98 23.93,20.02 24.84,20.02 v25.27,19.58
N$1  (via drill 0.3)
  Top 0.127: R8.1 v28.08,5.65 v28.09,5.64
  Bottom 0.127: v28.09,5.64 28.09,3.33 J2.2
QSPI_SCLK
  Top 0.127: U4.52 21.37,9.11 21.71,8.77 21.71,8.01 21.98,7.74 U5.6
QSPI_SD0
  Top 0.127: U5.5 22.3,8.75 21.77,9.28 U4.53
QSPI_SD1
  Top 0.127: U4.55 22.57,9.48 23.09,8.97 25.68,8.97 26.04,8.61 26.04,7.67 25.61,7.24 U5.2
QSPI_SD2
  Top 0.127: U4.54 22.17,9.38 22.84,8.71 25.58,8.71 25.78,8.51 25.78,8.03 25.5,7.74 U5.3
QSPI_SD3
  Top 0.127: U4.51 20.97,9.13 21.45,8.65 21.45,7.77 22,7.22 22.28,7.22 U5.7
R_1  (via drill 0.3)
  Top 0.127: R16.5 41.43,20.45 v41.22,20.65 | U4.2 30.13,11.52 v30.66,12.04
  Bottom 0.127: v30.66,12.04 30.66,14.58 33.5,17.42 38,17.42 v41.22,20.65
R_1K  (via drill 0.3)
  Top 0.127: R17.7 43.16,15.93 40.85,15.93 v40.82,15.9 | U4.5 27.93,12.72 32.89,17.68 39.22,17.68 39.59,17.31 40.35,17.31 v40.97,17.93
  Bottom 0.127: v40.97,17.93 40.97,16.05 v40.82,15.9
R_1M  (via drill 0.3)
  Top 0.127: R15.6 v33.02,23.11 | U4.8 24.34,13.92 24.41,13.85 27.23,13.85 29.41,16.03 v29.41,16.2
  Bottom 0.127: v29.41,16.2 29.97,15.65 30.56,15.65 30.86,15.95 30.86,18.26 33.02,20.42 v33.02,23.11
R_10
  Top 0.127: U4.3 28.18,11.91 33.28,17.02 37.59,17.02 37.81,16.8 41.69,16.8 42.03,17.14 R17.5
R_10K  (via drill 0.3)
  Top 0.127: R17.8 40.21,15.37 v39.98,15.6 | v40.06,17.8 39.78,18.09 32.84,18.09 27.87,13.12 U4.6
  Bottom 0.127: v40.06,17.8 39.98,17.8 v39.98,15.6
R_10M  (via drill 0.3)
  Top 0.127: R15.7 33.79,22.61 v33.53,22.35 | U4.9 24.44,14.32 24.66,14.1 26.67,14.1 28.63,16.05 v28.63,16.18
  Bottom 0.127: v33.53,22.35 33.53,20.34 31.39,18.21 31.39,15.75 30.89,15.24 29.49,15.24 28.63,16.1 v28.63,16.18
R_100  (via drill 0.3)
  Top 0.127: U4.4 28.09,12.32 33.15,17.37 39.01,17.37 39.33,17.06 41.19,17.06 v41.91,17.78 | v42.34,16.45 42.4,16.51 R17.6
  Bottom 0.127: v41.91,17.78 42.34,17.35 v42.34,16.45
R_100K  (via drill 0.3)
  Top 0.127: R15.5 32.38,23.75 v32.26,23.62 | U4.7 27.7,13.52 30.19,16.01 v30.19,16.24
  Bottom 0.127: v30.19,16.24 30.23,16.27 30.23,18.26 32.26,20.3 v32.26,23.62
RT_1
  pour Top (isolate 0.254, no thermals): 78.82,1.52 78.82,3.99 78.05,4.75 78.05,6.43 78.49,6.86 81.74,6.86 81.74,5.28 79.17,2.72 79.17,1.52
RT_1K
  Top 0.508: Q8.3 R28.1
RT_1M
  Top 0.508: Q4.3 R22.1
RT_10
  pour Top (isolate 0.254, no thermals): 85.01,1.52 85.01,3.99 85.8,4.78 85.8,5.54 86.08,5.82 86.08,6.86 82.6,6.86 82.6,4.8 84.68,2.72 84.68,1.52
RT_10K
  Top 0.508: Q7.3 R26.1
RT_10M
  Top 0.508: Q2.3 76.71,19.62 78.16,18.18 R21.1
RT_100
  Top 0.508: 89.92,5.59 90.68,4.83
  pour Top (isolate 0.254, no thermals): 86.87,5.71 89.28,3.3 89.92,3.3 90.5,2.72 90.5,1.52 90.86,1.52 90.86,4.9 88.65,7.11 86.87,7.11
RT_100K
  Top 0.508: Q5.3 R24.1
SWDCLK  (via drill 0.3)
  Top 0.127: U4.24 19.37,17.84 19.1,18.11 18.8,18.11 18.64,18.27 18.64,18.45 17.27,19.81 17.27,20.83 16.51,21.59 v14.17,21.59
  Bottom 0.127: J100.4 v14.17,21.59
SWDIO  (via drill 0.3)
  Top 0.127: U4.25 18.97,17.58 18.38,18.17 18.38,18.27 16.78,19.88 v16.78,20.57
  Bottom 0.127: v16.78,20.57 16.78,21.07 15.44,22.4 J100.2
TC_10UF  (via drill 0.3)
  Top 0.254: R16.3 45.72,19.81 46.99,18.54 v53.82,18.54 | v72.14,2.29 73.2,2.29 Q1.1
  Bottom 0.254: v53.82,18.54 54.97,18.54 62.13,11.38 62.13,6.76 66.6,2.29 v72.14,2.29
TC_PWM
  Top 0.254: R15.1 46.86,21.97 48.51,20.32 56.13,20.32 58.67,17.78 60.2,17.78 61.47,16.51 68.83,16.51 70.1,17.78 70.87,17.78 72.45,19.37 C29.1
TLED_B
  Top 0.127: U6.5 26.05,21.41 R7.4
TLED_G
  Top 0.127: R7.2 27.07,21.74 27.5,22.16 U6.1
TLED_R
  Top 0.127: R7.3 26.57,22 26.77,22.2 U6.3
TR_1  (via drill 0.3)
  Top 0.254: R16.4 46.23,20.45 47.55,19.13 55.3,19.13 v55.37,19.05 | Q3.1 77.49,0.81 v77.47,0.81
  Bottom 0.254: v55.37,19.05 55.37,18.92 63.07,11.23 63.07,7.32 66.65,3.73 76.28,3.73 77.47,2.54 v77.47,0.81
TR_1K  (via drill 0.3)
  Top 0.127: Q8.1 88.53,23.23 87.76,24 86.33,24 v85.95,23.62 | v46.35,15.32 45.66,16.01 R17.2
  Bottom 0.127: v85.95,23.62 84.33,23.62 84.29,23.58 71.34,23.58 68,20.24 48.64,20.24 45.47,17.07 45.47,16.2 v46.35,15.32
TR_1M
  Top 0.127: Q4.1 80.15,22.97 78.92,24.21 48.34,24.21 47.24,23.11 R15.3
TR_10  (via drill 0.3)
  Top 0.254: R17.4 48.39,17.14 49.23,17.98 54.05,17.98 54.18,18.11 v56.97,18.11 | Q6.1 83.34,0.84 v83.31,0.81
  Bottom 0.254: v83.31,0.81 83.31,4.57 82.19,5.69 66.45,5.69 63.93,8.2 63.93,11.15 v56.97,18.11
TR_10K  (via drill 0.3)
  Top 0.127: Q7.1 85.74,22.46 84.07,24.13 v83.06,24.13 | R17.1 44.72,15.37 44.8,15.29 45.37,15.29 v45.39,15.27
  Bottom 0.127: v83.06,24.13 83.01,24.08 71.07,24.08 67.72,20.73 48.16,20.73 44.96,17.53 44.96,15.7 v45.39,15.27
TR_10M
  Top 0.127: Q2.1 77.36,22.46 75.95,23.88 48.77,23.88 47.5,22.61 R15.2
TR_100  (via drill 0.3)
  Top 0.254: R17.3 48.61,16.51 49.62,17.53 56.64,17.53 57.66,16.51 v59.44,16.51 | Q9.1 89.18,0.84 v89.15,0.81
  Bottom 0.254: v89.15,0.81 89.15,3.61 86.16,6.6 67.49,6.6 64.82,9.27 64.82,12.72 61.04,16.51 v59.44,16.51
TR_100K
  Top 0.127: Q5.1 82.95,22.72 81.17,24.5 47.87,24.5 47.12,23.75 R15.4
UART1_RX  (via drill 0.3)
  Top 0.127: U4.37 16.43,13.12 16.13,13.41 12.39,13.41 9.91,15.9 v9.91,21.34
  Bottom 0.127: v9.91,21.34 11.43,21.34 11.68,21.08 11.68,19.43 J100.7
UART1_TX  (via drill 0.3)
  Top 0.127: U4.36 16.5,13.52 16.35,13.67 12.5,13.67 10.41,15.75 10.41,19.56 v12.19,21.34
  Bottom 0.127: v12.19,21.34 11.63,21.89 J100.8
USB_DTM
  Top 0.127: U4.46 18.97,9.67 17.83,8.53 17.3,8.53 16.74,7.98 R3.2
USB_DTP
  Top 0.127: U4.47 19.37,9.58 R4.2
USB_N
  Top 0.254: J1.B7 8.78,13.45 U2.6 | U2.6 8.9,12.69 9.37,12.22 10.77,12.22 11.3,11.68 11.3,9.63 13.99,6.94 R3.1 | J1.A7 8.01,12.45 U2.6
USB_P
  Top 0.254: J1.A6 6.47,12.95 6.25,12.72 6.25,12.17 6.46,11.95 J1.B6 8.5,11.95 8.9,11.55 U2.1 8.9,10.51 9.98,9.42 10.64,9.42 13.84,6.22 17.48,6.22 17.73,6.48 R4.1
USB_V  (via drill 0.3)
  Top 0.381: U1.3 2.79,3.56 2.6,3.75 2.52,3.83
  Top 0.508: 2.6,3.75 3.58,4.72 4.27,4.72 C5.2 4.59,4.45 7.01,4.45 7.98,5.41 7.98,7.07 9.04,8.13 v9.04,8.21 9.04,9.25 v9.02,9.27 9.02,9.32 8.03,10.31 7.3,10.31 J1.B4/A9 | 2.52,3.83 C1.2 | J1.A4/B9 v8.37,15.1 | v8.37,15.1 v8.38,15.11 | v9.02,15.11 9,15.1 v8.37,15.1
  Bottom 0.508: v9.04,8.21 9.04,9.25 v9.02,9.27 9.02,9.32 7.62,10.72 7.62,14.35 v8.38,15.11 v9.02,15.11
VIN
  Top 0.381: U8.1 47.26,11.75 47.45,11.94 C25.1
  Top 0.508: U7.4 36.18,5.67 35.1,6.76 34.75,7.11 | U3.1 11.29,3.04 11.43,3.17 | U3.3 13.19,2.94 12.95,3.17 | 40.62,11.25 40.62,12.52 42.62,14.53 45.97,14.53 C25.1
  Top 0.762: FB1.2 7.94,3.37 8.87,4.29 C6.1 9.8,4.29 10.92,3.17 11.43,3.17 12.95,3.17 21.72,3.17 22.35,3.81 31.78,3.81 C22.1 35.1,6.76 | 34.75,7.11 35.92,8.28 37.64,8.28 40.62,11.25
  pour Top (isolate 0.254, no thermals): 37.34,5.54 34.34,5.54 33.96,5.92 33.96,7.42 36.27,7.42 37.34,6.35
VIN_F
  Top 0.381: U1.5 U1.4 3.3,1.73 2.68,2.35 C2.2 2.5,1.36 C4.2 2.81,1.05 6.34,1.05 FB1.1
VSET_BUCK_1V0  (via drill 0.3)
  Top 0.127: U4.32 15.87,15.12 14.99,16 v13.46,16 | v35.31,1.27 v35.31,1.28 R11.1
  Bottom 0.127: v13.46,16 13.97,15.49 13.97,12.19 19.05,7.11 31.93,7.11 35.43,3.61 35.43,1.4 v35.31,1.27
VSET_BUCK_1V8  (via drill 0.3)
  Top 0.127: U4.34 15.69,14.32 15.59,14.22 13.83,14.22 13.82,14.22 12.95,14.22 12.45,14.73 v12.45,14.86 | R11.2 35.89,2.1 31.69,2.1 v30.99,2.79
  Top 0.254: R11.2 R12.1
  Bottom 0.127: v30.99,2.79 29.97,3.81 29.97,5.59 28.96,6.6 21.15,6.6 21.01,6.74 18.4,6.74 13.72,11.43 13.72,13.59 v12.45,14.86
VSET_BUCK_3V3  (via drill 0.3)
  Top 0.127: U4.35 16.91,13.94 12.63,13.94 11.91,14.66 11.91,15.44 v11.96,15.49 | R12.2 36.58,0.76 31.75,0.76 v30.99,1.52
  Top 0.254: R13.1 R12.2
  Bottom 0.127: v30.99,1.52 29.46,3.05 29.46,5.33 28.59,6.21 22.21,6.21 21.08,5.08 19.05,5.08 14.48,9.65 13.17,9.65 12.59,10.23 12.59,10.27 11.95,10.91 v11.95,15.48 v11.96,15.49
VSET_LDO_1V8  (via drill 0.3)
  Top 0.127: U4.38 16.12,12.72 v15.97,12.88 | v42.67,9.4 43.73,9.4 R18.1
  Bottom 0.127: v15.97,12.88 18.11,12.88 21.34,9.65 32.16,9.65 33.25,8.56 41.83,8.56 v42.67,9.4
VSET_LDO_3V3  (via drill 0.3)
  Top 0.127: v42.67,10.41 R18.2 | U4.39 15.79,12.32 v15.23,12.88
  Top 0.254: R19.1 R18.2
  Bottom 0.127: v42.67,10.41 43.18,9.91 43.18,8.89 42.42,8.13 33.12,8.13 32.05,9.2 21.43,9.2 18.31,12.32 15.79,12.32 v15.23,12.88
X0  (via drill 0.3)
  Top 0.127: R10.1 36.39,20.07 38.1,20.07 v40.13,22.1 | J3.1 58.53,20.46 57.39,21.6 U9.4 v55.89,21.6 v55.88,21.59
  Bottom 0.127: v40.13,22.1 40.74,22.71 44.86,22.71 45.97,21.59 v55.88,21.59
X1  (via drill 0.3)
  Top 0.127: R10.2 37.6,20.58 v38.86,21.84 | J3.3 64.49,21.61 63.21,22.9 U9.6 56.05,22.9 v55.93,22.78
  Bottom 0.127: v38.86,21.84 40.66,23.65 45.7,23.65 46.56,22.78 v55.93,22.78
X2  (via drill 0.3)
  Top 0.127: R10.3 37.05,21.08 v37.9,21.92 | J3.5 69.57,21.36 67.56,23.37 55.5,23.37 55.03,22.9 U9.1 53.22,22.9 v52.81,23.32
  Bottom 0.127: v37.9,21.92 40.28,24.31 46.81,24.31 47.8,23.32 v52.81,23.32
XIN
  Top 0.127: U4.20 20.97,17.92 21.84,18.8 21.84,20.02 22.28,20.45 23.14,20.45 23.93,21.23 C19.1 23.02,22.61 X1.3
XOUT
  Top 0.127: U4.21 20.57,17.9 21.46,18.8 21.46,20.07 20.92,20.61 R5.2
XOUT_R
  Top 0.127: R5.1 C12.1 19.81,21.4 X1.1

### Text on the board
tNames: V- | V+ | X0 / GND / X1 / GND / X2 | I+ | I- | EXT | I- / GND | JS220 Evaluation Kit 1 / Rev B / Jetperch LLC | BOOTSEL | 20220706
bNames: V- | V+ | I+ | I- | SWD / + / UART
Measures: Dimensions in millimeters
Document: B
FabDoc1: FABRICATION NOTES / / 1. GENERAL / a. Fabricate pcb in accordance with the current revision / of IPC-6012, class 2. / b. Interpret dimensions and tolerances in accordance with the / current revision of ASME Y14.5M. / c. FR4 Tg 150C or equivalent / with er approximately 4.6 @ 480 MHz, / RoHS & REACH compliant. / d. Bow and twist of assembled pwb shall not exceed / 0.025 mm per mm. / e. Minimum sizes: 5 mil width, 5 mil spacing, 10 mil holes / f. Surface finish: ENIG / g. Finished hole sizes measured after plating / h. Finished thickness is 0.063" ± 10% / i. All holes shall be located within 3 mil of true CAD position / k. Adding copper (such as theiving) is not allowed. / / 2. STACKUP / Soldermask (soldermask_top.gbr) / 1.4 mil 1 oz finished copper (copper_top_l1.gbr) / 6.7 mil FR4 Tg150 or equivalent prepreg / 0.7 mil 0.5 oz copper (copper_inner_l2.gbr) / 47 mil FR4 Tg150 or equivalent core / 0.7 mil 0.5 oz copper (copper_inner_l3.gbr) / 6.7 mil FR4 Tg150 or equivalent prepreg / 1.4 mil 1 oz finished copper (copper_bottom_l4.gbr) / Soldermask (soldermask_bottom.gbr) / / 3. SOLDERMASK / a. Color: black / b. No bleed-out allowed over exposed smd pads. / c. No exposed traces. / d. Do not expand solder mask openings. / / 4. SILKSCREEN / a. Both sides / b. White epoxy, non-conductive, non-nutrient ink / c. Clip silkscreen away from any exposed metal. / d. Place vendor markings on bottom side. | PANELIZATION NOTES / / 1. 10 up arranged as 5 x 2 / 2. Add 3 panel fiducials to each side / 3. Add 4 tooling holes to panel / 4. Route ends of each board / 5. Route under J3 in area between boards. / 5. V-score all 4 sides of each board.
FabDoc2: ASSEMBLY NOTES / / 1. Use lead-free solder (RoHS/REACH) / 2. Wash board to remove flux residue. / 3. Assemble top-side only.